# EAGLE schematic Avionics-Test (EAGLE 9.6.2)
DESIGNER: Gabe Adamson; PART_NUMBER: 68-0004; PROJECT: CougSat-1: Avionics; REV: 1.1.5

## Sheet 1 of 14
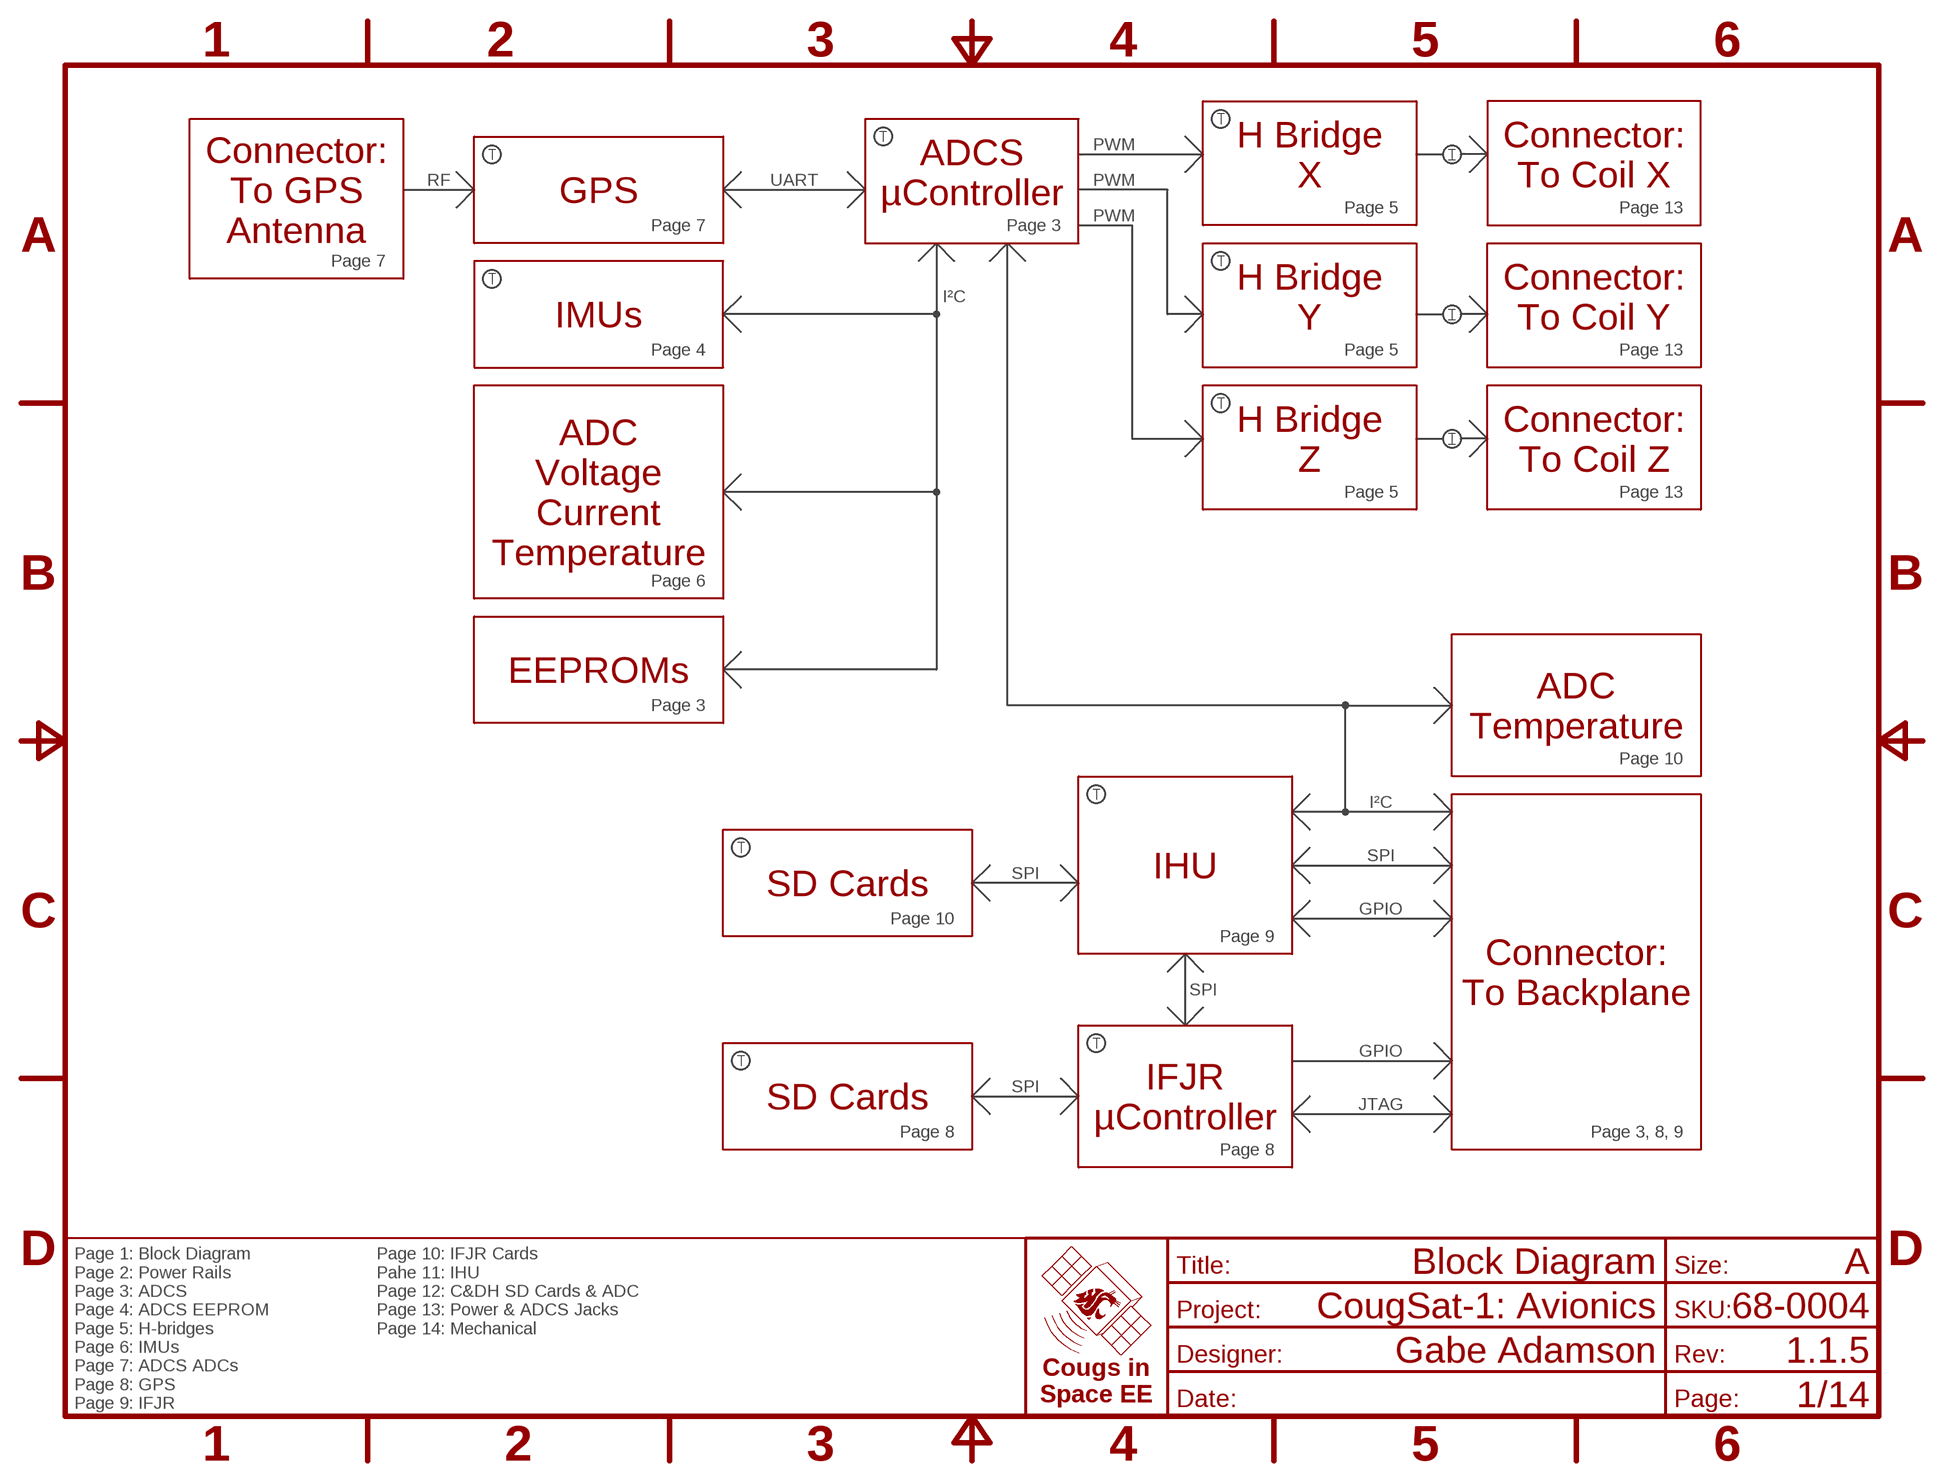
[diagram p0: schematic, sheet 1]
FRAME1 (FRAME-A): TITLE: Block Diagram

### Notes on the sheet
- PWM
- H Bridge
  X
- Connector:
  To Coil X
- ADCS
  µController
- RF | UART | PWM
- Connector:
  To GPS
  Antenna
- GPS
- Page 5 | Page 13
- Page 7 | Page 3 | PWM
- Page 7
- I²C
- H Bridge
  Y
- Connector:
  To Coil Y
- IMUs
- Page 4 | Page 5 | Page 13
- H Bridge
  Z
- Connector:
  To Coil Z
- ADC
  Voltage
  Current
  Temperature
- Page 5 | Page 13
- Page 6
- EEPROMs
- Page 3
- ADC
  Temperature
- Page 10
- I²C
- IHU | SPI
- SD Cards | SPI
- Page 10 | GPIO
- Page 9
- Connector:
  To Backplane
- SPI
- GPIO
- SD Cards | SPI
- IFJR
  µController
- JTAG
- Page 8 | Page 3, 8, 9
- Page 8
- Page 1: Block Diagram
  Page 2: Power Rails
  Page 3: ADCS
  Page 4: ADCS EEPROM
  Page 5: H-bridges
  Page 6: IMUs
  Page 7: ADCS ADCs
  Page 8: GPS
  Page 9: IFJR
- Page 10: IFJR Cards
  Pahe 11: IHU
  Page 12: C&DH SD Cards & ADC
  Page 13: Power & ADCS Jacks
  Page 14: Mechanical

## Sheet 2 of 14
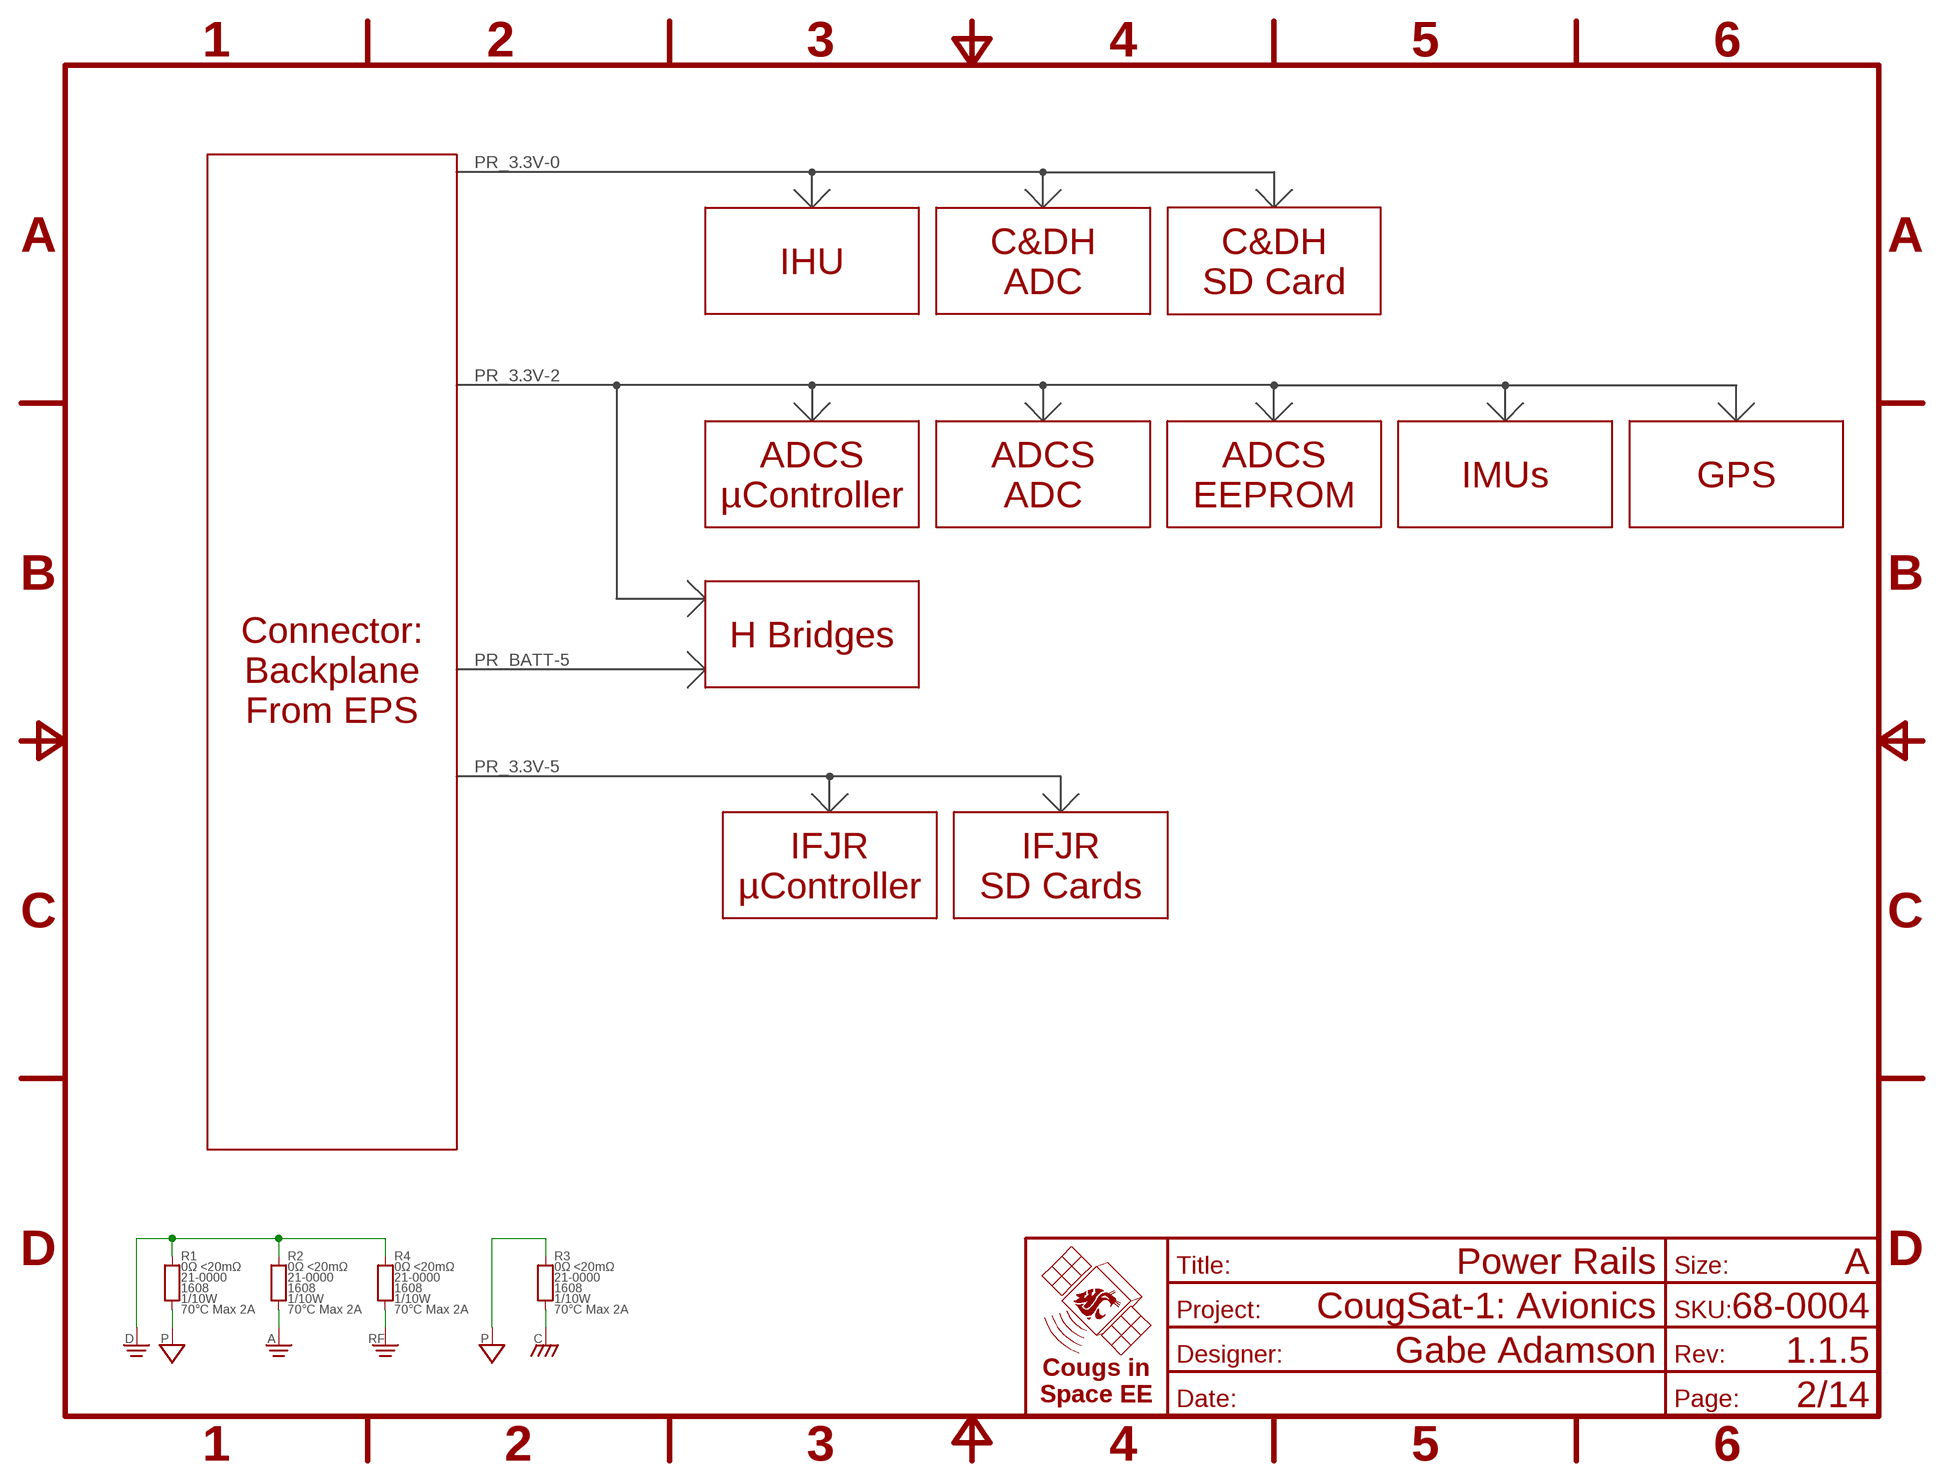
[diagram p1: schematic, sheet 2]
FRAME2 (FRAME-A): TITLE: Power Rails

### Parts
R1  0Ω <20mΩ  RES-V-0-1608  [1608]
R2  0Ω <20mΩ  RES-V-0-1608  [1608]
R3  0Ω <20mΩ  RES-V-0-1608  [1608]
R4  0Ω <20mΩ  RES-V-0-1608  [1608]

### Nets
AGND [Power]: R2.1 ; also sheet 3,5,6,7,8,9,10,11,12
CHASSIS [Power]: R3.1 ; also sheet 13
DGND [Power]: R1.2 R2.2 R4.2 ; also sheet 3,4,6,7,8,9,10,11,12,13
PGND [Power]: R1.1 R3.2 ; also sheet 5,13
RFGND [Power]: R4.1 ; also sheet 8

### Notes on the sheet
- PR_3.3V-0
- IHU
- C&DH
  ADC
- C&DH
  SD Card
- PR_3.3V-2
- ADCS
  µController
- ADCS
  ADC
- ADCS
  EEPROM
- IMUs | GPS
- H Bridges
- PR_BATT-5
- Connector:
  Backplane
  From EPS
- PR_3.3V-5
- IFJR
  µController
- IFJR
  SD Cards

## Sheet 3 of 14
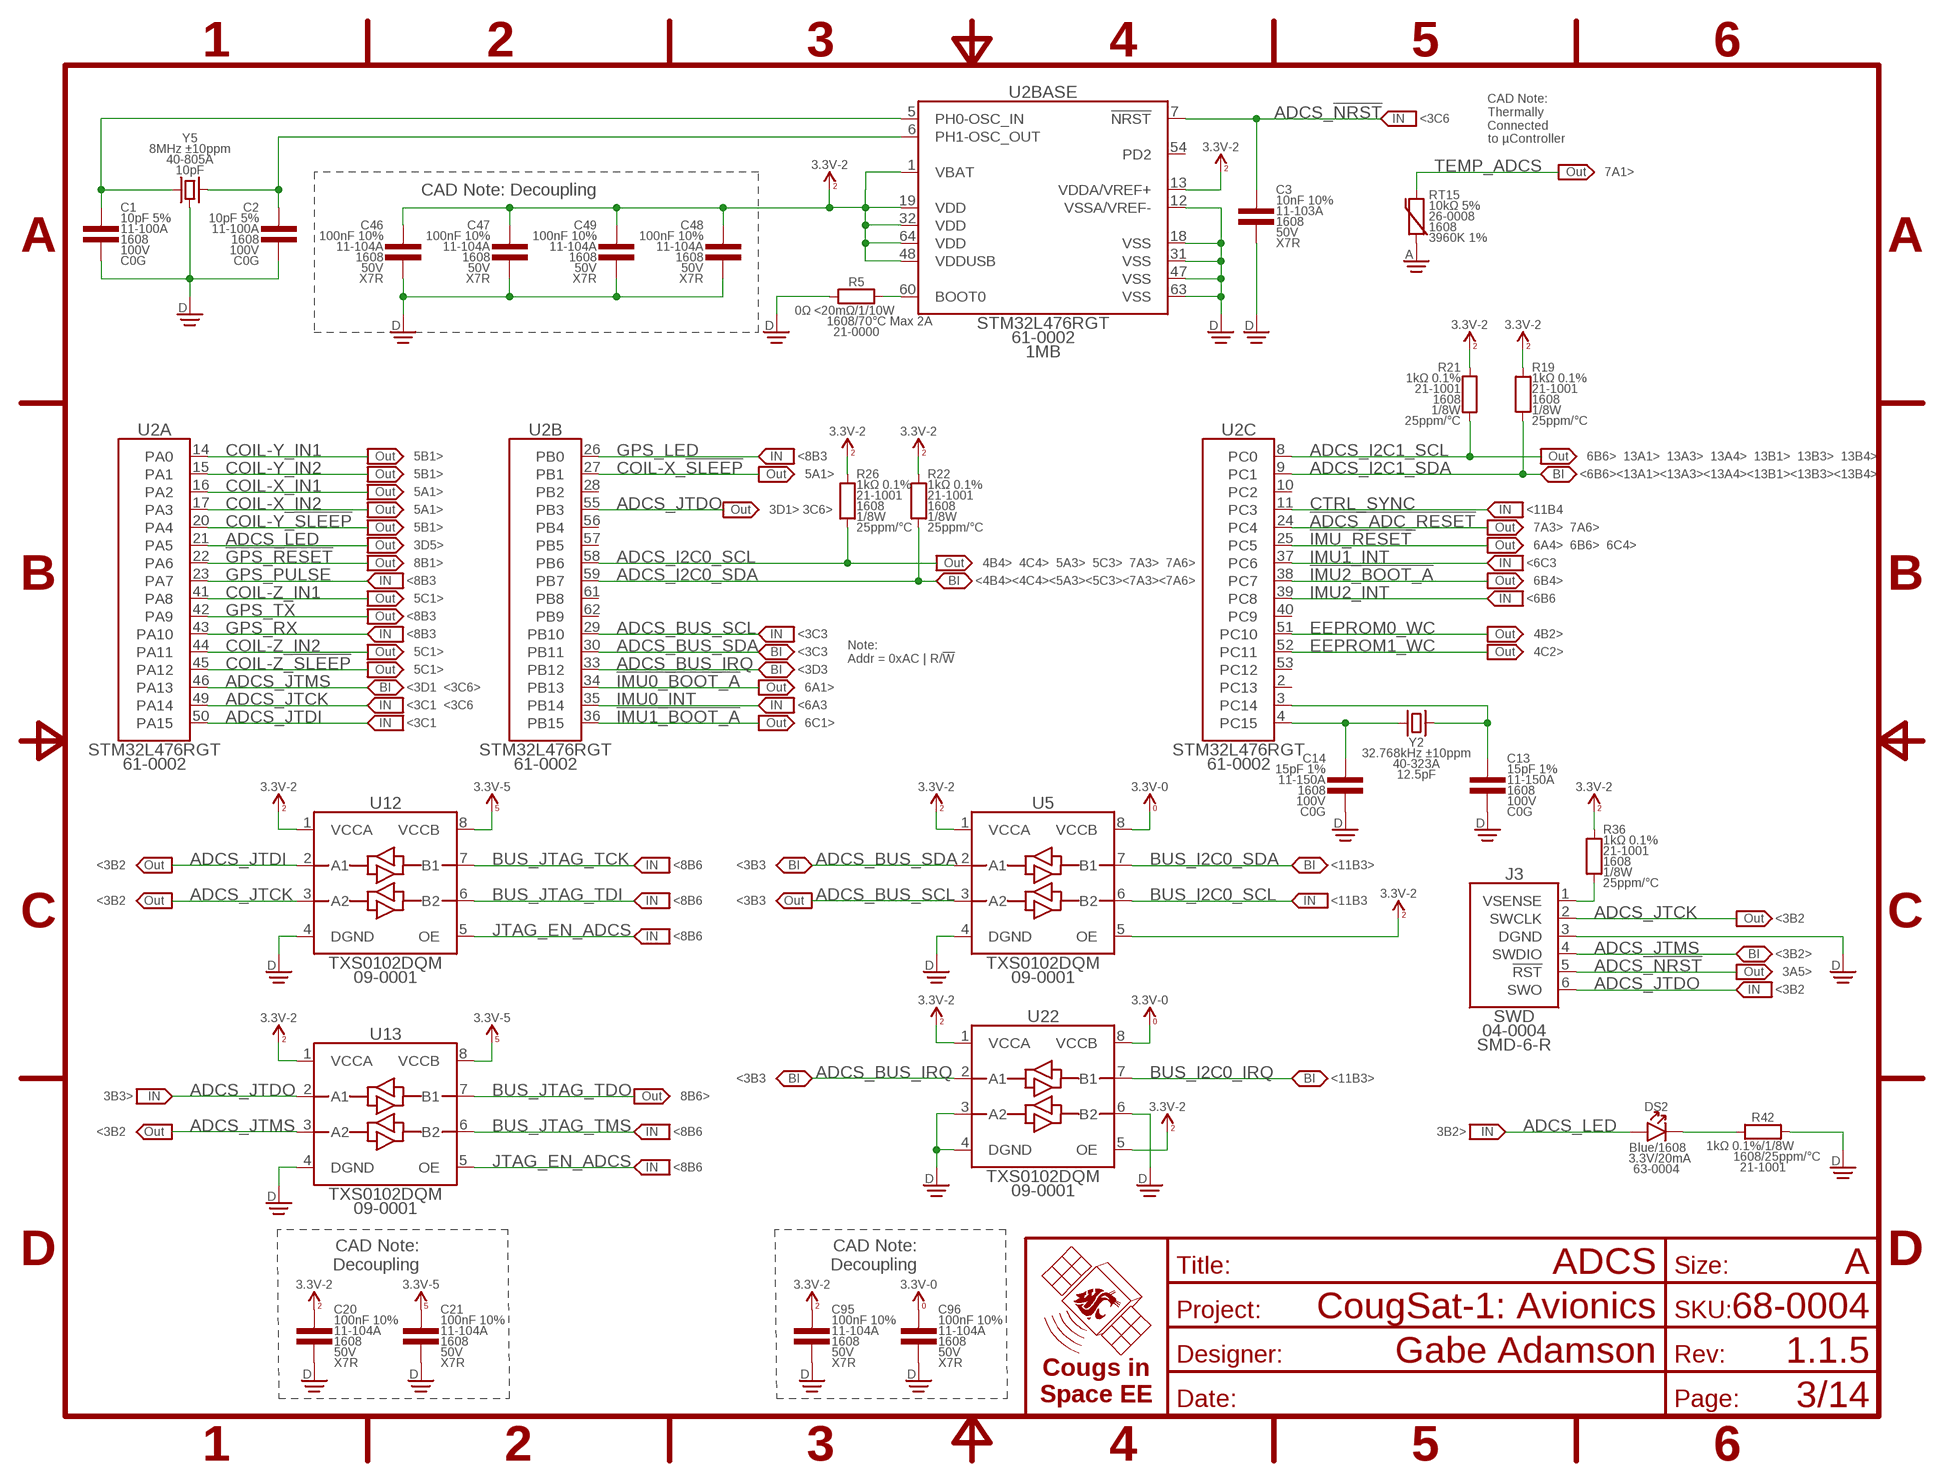
[diagram p2: schematic, sheet 3]
FRAME4 (FRAME-A): TITLE: ADCS

### Parts
C1  10pF 5%  CAP-V-10PF-1608  [1608]
C2  10pF 5%  CAP-V-10PF-1608  [1608]
C3  10nF 10%  CAP-V-10NF-1608  [1608]
C13  15pF 1%  CAP-V-15PF-1608  [1608]
C14  15pF 1%  CAP-V-15PF-1608  [1608]
C20  100nF 10%  CAP-V-100NF-1608  [1608]
C21  100nF 10%  CAP-V-100NF-1608  [1608]
C46  100nF 10%  CAP-V-100NF-1608  [1608]
C47  100nF 10%  CAP-V-100NF-1608  [1608]
C48  100nF 10%  CAP-V-100NF-1608  [1608]
C49  100nF 10%  CAP-V-100NF-1608  [1608]
C95  100nF 10%  CAP-V-100NF-1608  [1608]
C96  100nF 10%  CAP-V-100NF-1608  [1608]
DS2  Blue  LED-H-BLU-1608  [1608-POL]
J3  SWD  SWDSMD-6-R  [SMD2.54-1X06-R]
R5  0Ω <20mΩ  RES-H-0-1608  [1608]
R19  1kΩ 0.1%  RES-V-1K-1608  [1608]
R21  1kΩ 0.1%  RES-V-1K-1608  [1608]
R22  1kΩ 0.1%  RES-V-1K-1608  [1608]
R26  1kΩ 0.1%  RES-V-1K-1608  [1608]
R36  1kΩ 0.1%  RES-V-1K-1608  [1608]
R42  1kΩ 0.1%  RES-H-1K-1608  [1608]
RT15  10kΩ 5%  THERMISTOR-V-10K-1608  [1608]
U2  STM32L476RGT  STM32-64P-L476RGT  [QFP-64-1010]
U5  TXS0102DQM  LEVEL_SHIFTER-2BIT-XSON-8  [X2SON-8]
U12  TXS0102DQM  LEVEL_SHIFTER-2BIT-XSON-8  [X2SON-8]
U13  TXS0102DQM  LEVEL_SHIFTER-2BIT-XSON-8  [X2SON-8]
U22  TXS0102DQM  LEVEL_SHIFTER-2BIT-XSON-8  [X2SON-8]
Y2  32.768kHz ±10ppm  CRYSTAL-32.768K-SMD-3215  [SMD-3215]
Y5  8MHz ±10ppm  CRYSTAL-GROUNDED-8M-SMD-5032  [SMD-5032]

### Nets
3.3V_0 [Power]: C96.1 U5.8(VCCB) U22.8(VCCB) ; supply symbol labelled 3.3V-0 ; also sheet 9,11,12,13
3.3V_2 [Power]: C20.1 C46.1 C47.1 C48.1 C49.1 C95.1 R19.2 R21.2 R22.2 R26.2 R36.2 U2.1(BASE:VBAT) U2.13(BASE:VDDA/VREF+) U2.19(BASE:VDD) U2.32(BASE:VDD) U2.48(BASE:VDDUSB) U2.64(BASE:VDD) U5.1(VCCA) U5.5(OE) U12.1(VCCA) U13.1(VCCA) U22.1(VCCA) U22.5(OE) ; supply symbol labelled 3.3V-2 ; also sheet 4,5,6,7,8,13
3.3V_5 [Power]: C21.1 U12.8(VCCB) U13.8(VCCB) ; supply symbol labelled 3.3V-5 ; also sheet 9,10,11,13
!ADCS_ADC_RESET!: U2.24(C:PC4) ; also sheet 7
!GPS_RESET: U2.22(A:PA6) ; also sheet 8
!IMU0_BOOT_A: U2.34(B:PB13) ; also sheet 6
!IMU1_BOOT_A: U2.36(B:PB15) ; also sheet 6
!IMU2_BOOT_A: U2.38(C:PC7) ; also sheet 6
!IMU_RESET: U2.25(C:PC5) ; also sheet 6
ADCS_!NRST: C3.1 J3.5(!RST) U2.7(BASE:!NRST)
ADCS_BOOT0: R5.2 U2.60(BASE:BOOT0)
ADCS_BUS_IRQ: U2.33(B:PB12) U22.2(A1)
ADCS_BUS_SCL: U2.29(B:PB10) U5.3(A2)
ADCS_BUS_SDA: U2.30(B:PB11) U5.2(A1)
ADCS_I2C0_SCL: R26.1 U2.58(B:PB6) ; also sheet 4,6,7
ADCS_I2C0_SDA: R22.1 U2.59(B:PB7) ; also sheet 4,6,7
ADCS_I2C1_SCL: R21.1 U2.8(C:PC0) ; also sheet 6,13
ADCS_I2C1_SDA: R19.1 U2.9(C:PC1) ; also sheet 6,13
ADCS_JTCK: J3.2(SWCLK) U2.49(A:PA14) U12.3(A2)
ADCS_JTDI: U2.50(A:PA15) U12.2(A1)
ADCS_JTDO: J3.6(SWO) U2.55(B:PB3) U13.2(A1)
ADCS_JTMS: J3.4(SWDIO) U2.46(A:PA13) U13.3(A2)
ADCS_LED: DS2.A U2.21(A:PA5)
ADCS_LED_GND: DS2.C R42.1
ADCS_OSC_32_IN: C14.1 U2.4(C:PC15) Y2.1
ADCS_OSC_32_OUT: C13.1 U2.3(C:PC14) Y2.2
ADCS_OSC_IN [Power]: C1.1 U2.5(BASE:PH0-OSC_IN) Y5.1
ADCS_OSC_OUT: C2.1 U2.6(BASE:PH1-OSC_OUT) Y5.3
ADCS_SWD_VSENCE: J3.1(VSENSE) R36.1
AGND [Power]: RT15.1 ; also sheet 2,5,6,7,8,9,10,11,12
BUS_I2C0_IRQ: U22.7(B1) ; also sheet 11
BUS_I2C0_SCL: U5.6(B2) ; also sheet 11
BUS_I2C0_SDA: U5.7(B1) ; also sheet 11
BUS_JTAG_TCK: U12.7(B1) ; also sheet 9,11
BUS_JTAG_TDI: U12.6(B2) ; also sheet 9,11
BUS_JTAG_TDO: U13.7(B1) ; also sheet 9,11
BUS_JTAG_TMS: U13.6(B2) ; also sheet 9,11
COIL-X_!SLEEP: U2.27(B:PB1) ; also sheet 5
COIL-X_IN1: U2.16(A:PA2) ; also sheet 5
COIL-X_IN2: U2.17(A:PA3) ; also sheet 5
COIL-Y_!SLEEP: U2.20(A:PA4) ; also sheet 5
COIL-Y_IN1: U2.14(A:PA0) ; also sheet 5
COIL-Y_IN2: U2.15(A:PA1) ; also sheet 5
COIL-Z_!SLEEP: U2.45(A:PA12) ; also sheet 5
COIL-Z_IN1: U2.41(A:PA8) ; also sheet 5
COIL-Z_IN2: U2.44(A:PA11) ; also sheet 5
CTRL_SYNC: U2.11(C:PC3) ; also sheet 9,11
DGND [Power]: C1.2 C2.2 C3.2 C13.2 C14.2 C20.2 C21.2 C46.2 C47.2 C48.2 C49.2 C95.2 C96.2 J3.3(DGND) R5.1 R42.2 U2.12(BASE:VSSA/VREF-) U2.18(BASE:VSS) U2.31(BASE:VSS) U2.47(BASE:VSS) U2.63(BASE:VSS) U5.4(DGND) U12.4(DGND) U13.4(DGND) U22.3(A2) U22.4(DGND) U22.6(B2) Y5.2(GND) Y5.4(GND) ; also sheet 2,4,6,7,8,9,10,11,12,13
EEPROM0_WC: U2.51(C:PC10) ; also sheet 4
EEPROM1_WC: U2.52(C:PC11) ; also sheet 4
GPS_LED: U2.26(B:PB0) ; also sheet 8
GPS_PULSE: U2.23(A:PA7) ; also sheet 8
GPS_RX: U2.43(A:PA10) ; also sheet 8
GPS_TX: U2.42(A:PA9) ; also sheet 8
IMU0_INT: U2.35(B:PB14) ; also sheet 6
IMU1_INT: U2.37(C:PC6) ; also sheet 6
IMU2_INT: U2.39(C:PC8) ; also sheet 6
JTAG_EN_ADCS: U12.5(OE) U13.5(OE) ; also sheet 9
TEMP_ADCS: RT15.2 ; also sheet 7
Unconnected: U2.2(C:PC13) U2.10(C:PC2) U2.28(B:PB2) U2.40(C:PC9) U2.53(C:PC12) U2.54(BASE:EXTRA_PIN) U2.56(B:PB4) U2.57(B:PB5) U2.61(B:PB8) U2.62(B:PB9)

### Notes on the sheet
- <3C6
- CAD Note:
  Thermally
  Connected
  to µController
- 7A1>
- CAD Note: Decoupling
- 5B1> | <8B3 | 6B6>  13A1>  13A3>  13A4>  13B1>  13B3>  13B4>
- 5B1> | 5A1> | <6B6><13A1><13A3><13A4><13B1><13B3><13B4>
- 5A1>
- 5A1> | 3D1> 3C6> | <11B4
- 5B1> | 7A3>  7A6>
- 3D5> | 6A4>  6B6>  6C4>
- 8B1> | 4B4>  4C4>  5A3>  5C3>  7A3>  7A6> | <6C3
- <8B3 | <4B4><4C4><5A3><5C3><7A3><7A6> | 6B4>
- 5C1> | <6B6
- <8B3
- <8B3 | <3C3 | 4B2>
- 5C1> | <3C3
- Note:
  Addr = 0xAC | R/!W!
- 4C2>
- 5C1> | <3D3
- <3D1  <3C6> | 6A1>
- <3C1  <3C6 | <6A3
- <3C1 | 6C1>
- <3B2 | <8B6 | <3B3 | <11B3>
- <3B2 | <8B6 | <3B3 | <11B3
- <3B2
- <8B6
- <3B2>
- 3A5>
- <3B2
- <3B3 | <11B3>
- 3B3> | 8B6>
- <3B2 | <8B6 | 3B2>
- <8B6
- CAD Note:
  Decoupling
- CAD Note:
  Decoupling

## Sheet 4 of 14
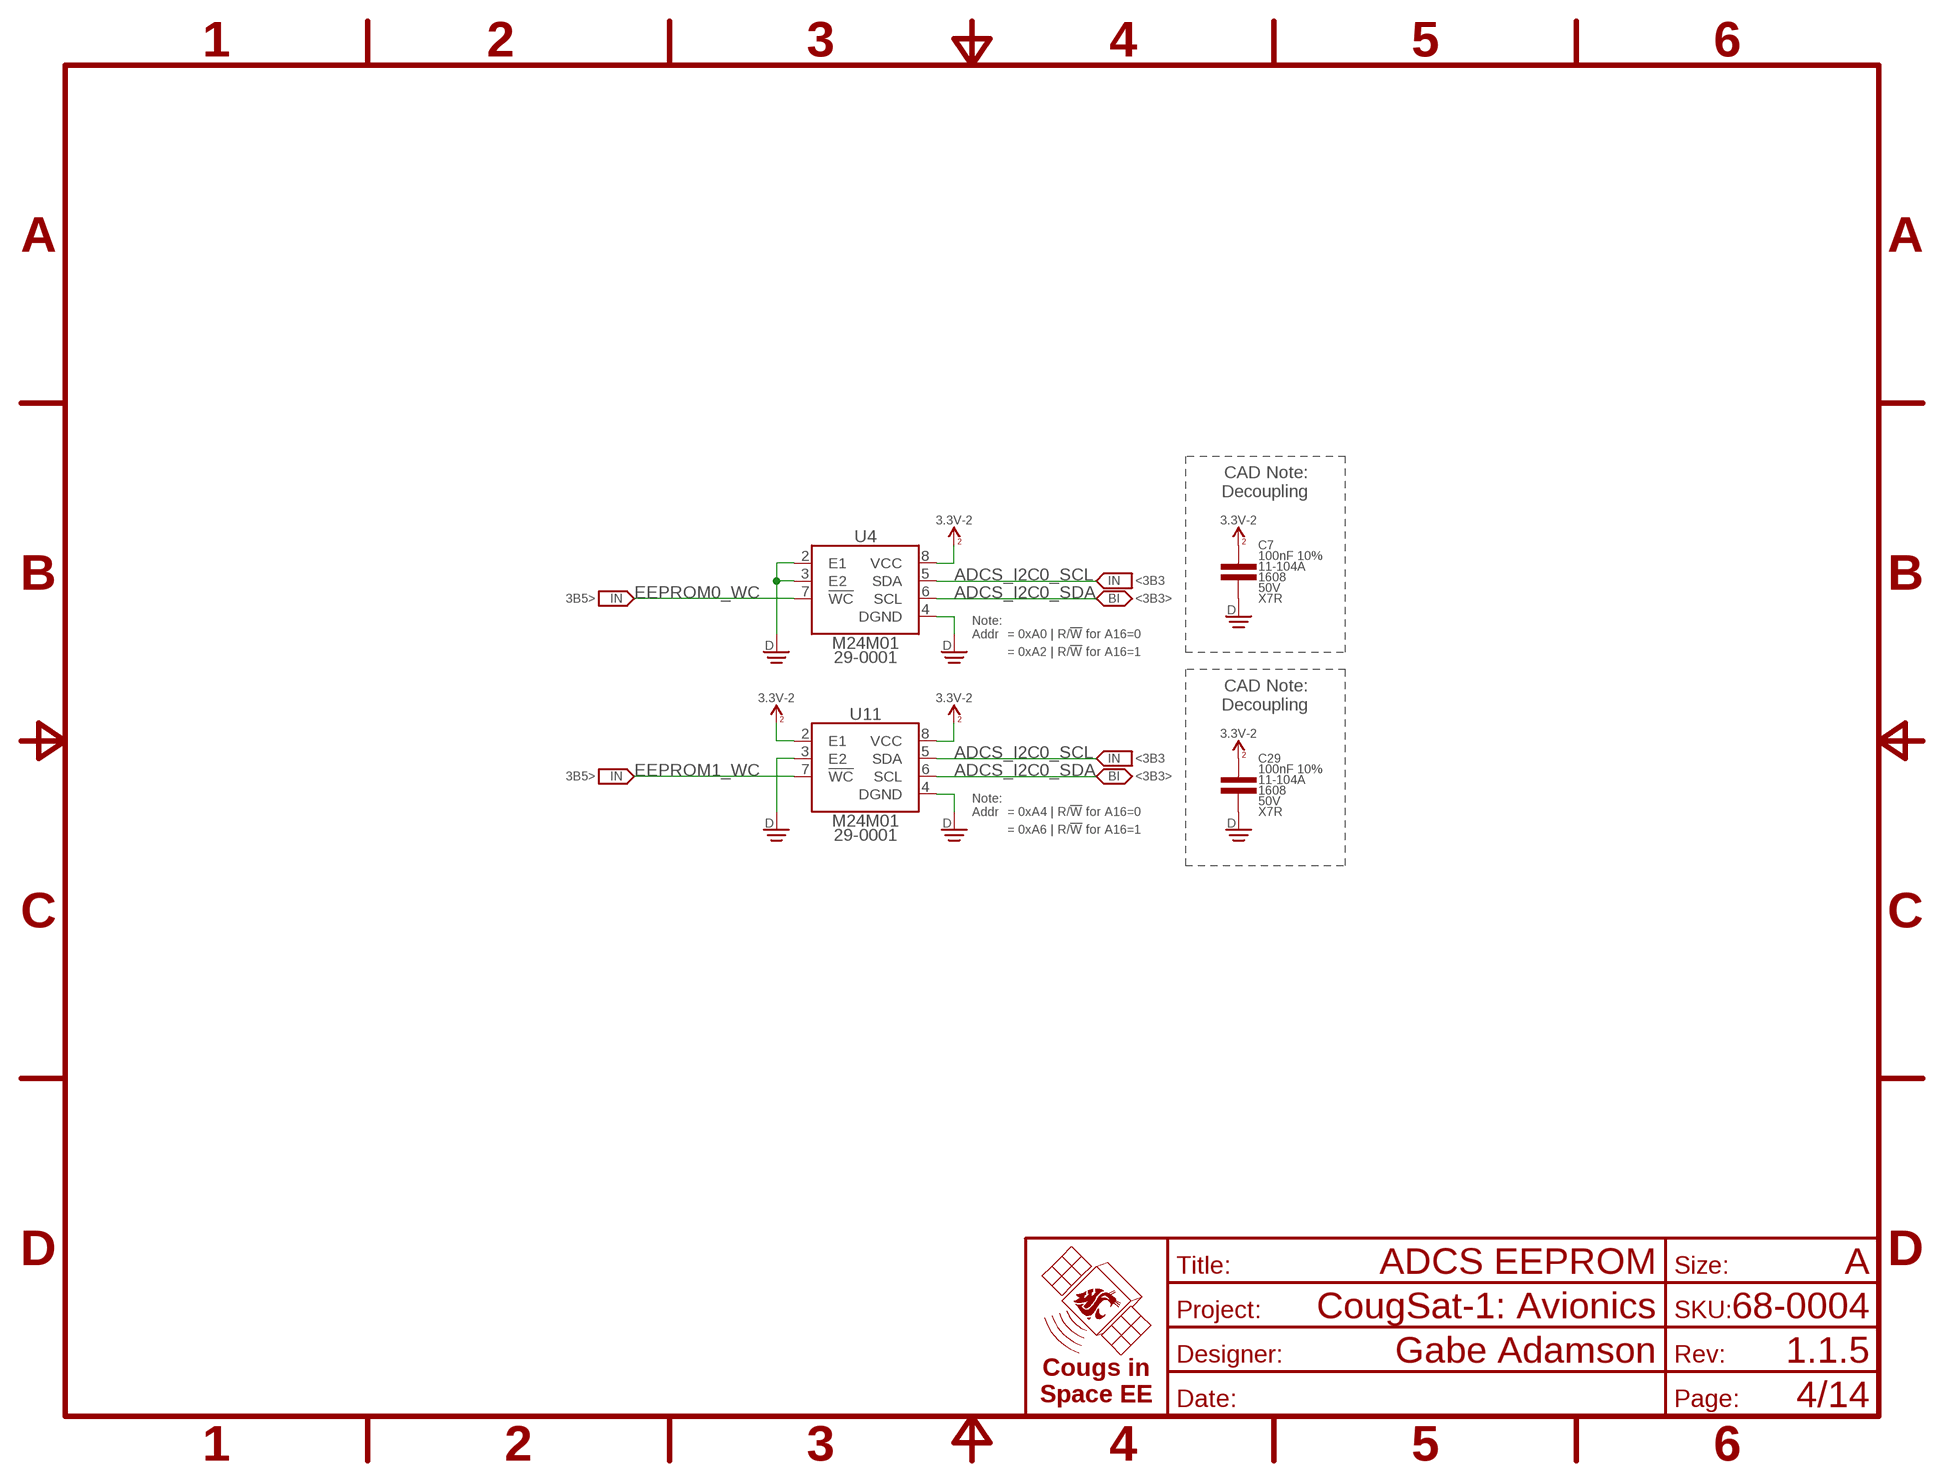
[diagram p3: schematic, sheet 4]
FRAME13 (FRAME-A): TITLE: ADCS EEPROM

### Parts
C7  100nF 10%  CAP-V-100NF-1608  [1608]
C29  100nF 10%  CAP-V-100NF-1608  [1608]
U4  M24M01  EEPROM-I2C-4-128KB-SO8  [SO8]
U11  M24M01  EEPROM-I2C-4-128KB-SO8  [SO8]

### Nets
3.3V_2 [Power]: C7.1 C29.1 U4.8(VCC) U11.2(E1) U11.8(VCC) ; supply symbol labelled 3.3V-2 ; also sheet 3,5,6,7,8,13
ADCS_I2C0_SCL: U4.5(SDA) U11.5(SDA) ; also sheet 3,6,7
ADCS_I2C0_SDA: U4.6(SCL) U11.6(SCL) ; also sheet 3,6,7
DGND [Power]: C7.2 C29.2 U4.2(E1) U4.3(E2) U4.4(DGND) U11.3(E2) U11.4(DGND) ; also sheet 2,3,6,7,8,9,10,11,12,13
EEPROM0_WC: U4.7(!WC) ; also sheet 3
EEPROM1_WC: U11.7(!WC) ; also sheet 3

### Notes on the sheet
- CAD Note:
  Decoupling
- <3B3
- 3B5> | <3B3>
- Note:
  Addr
- = 0xA0 | R/!W! for A16=0
- = 0xA2 | R/!W! for A16=1
- CAD Note:
  Decoupling
- <3B3
- 3B5> | <3B3>
- Note:
  Addr
- = 0xA4 | R/!W! for A16=0
- = 0xA6 | R/!W! for A16=1

## Sheet 5 of 14
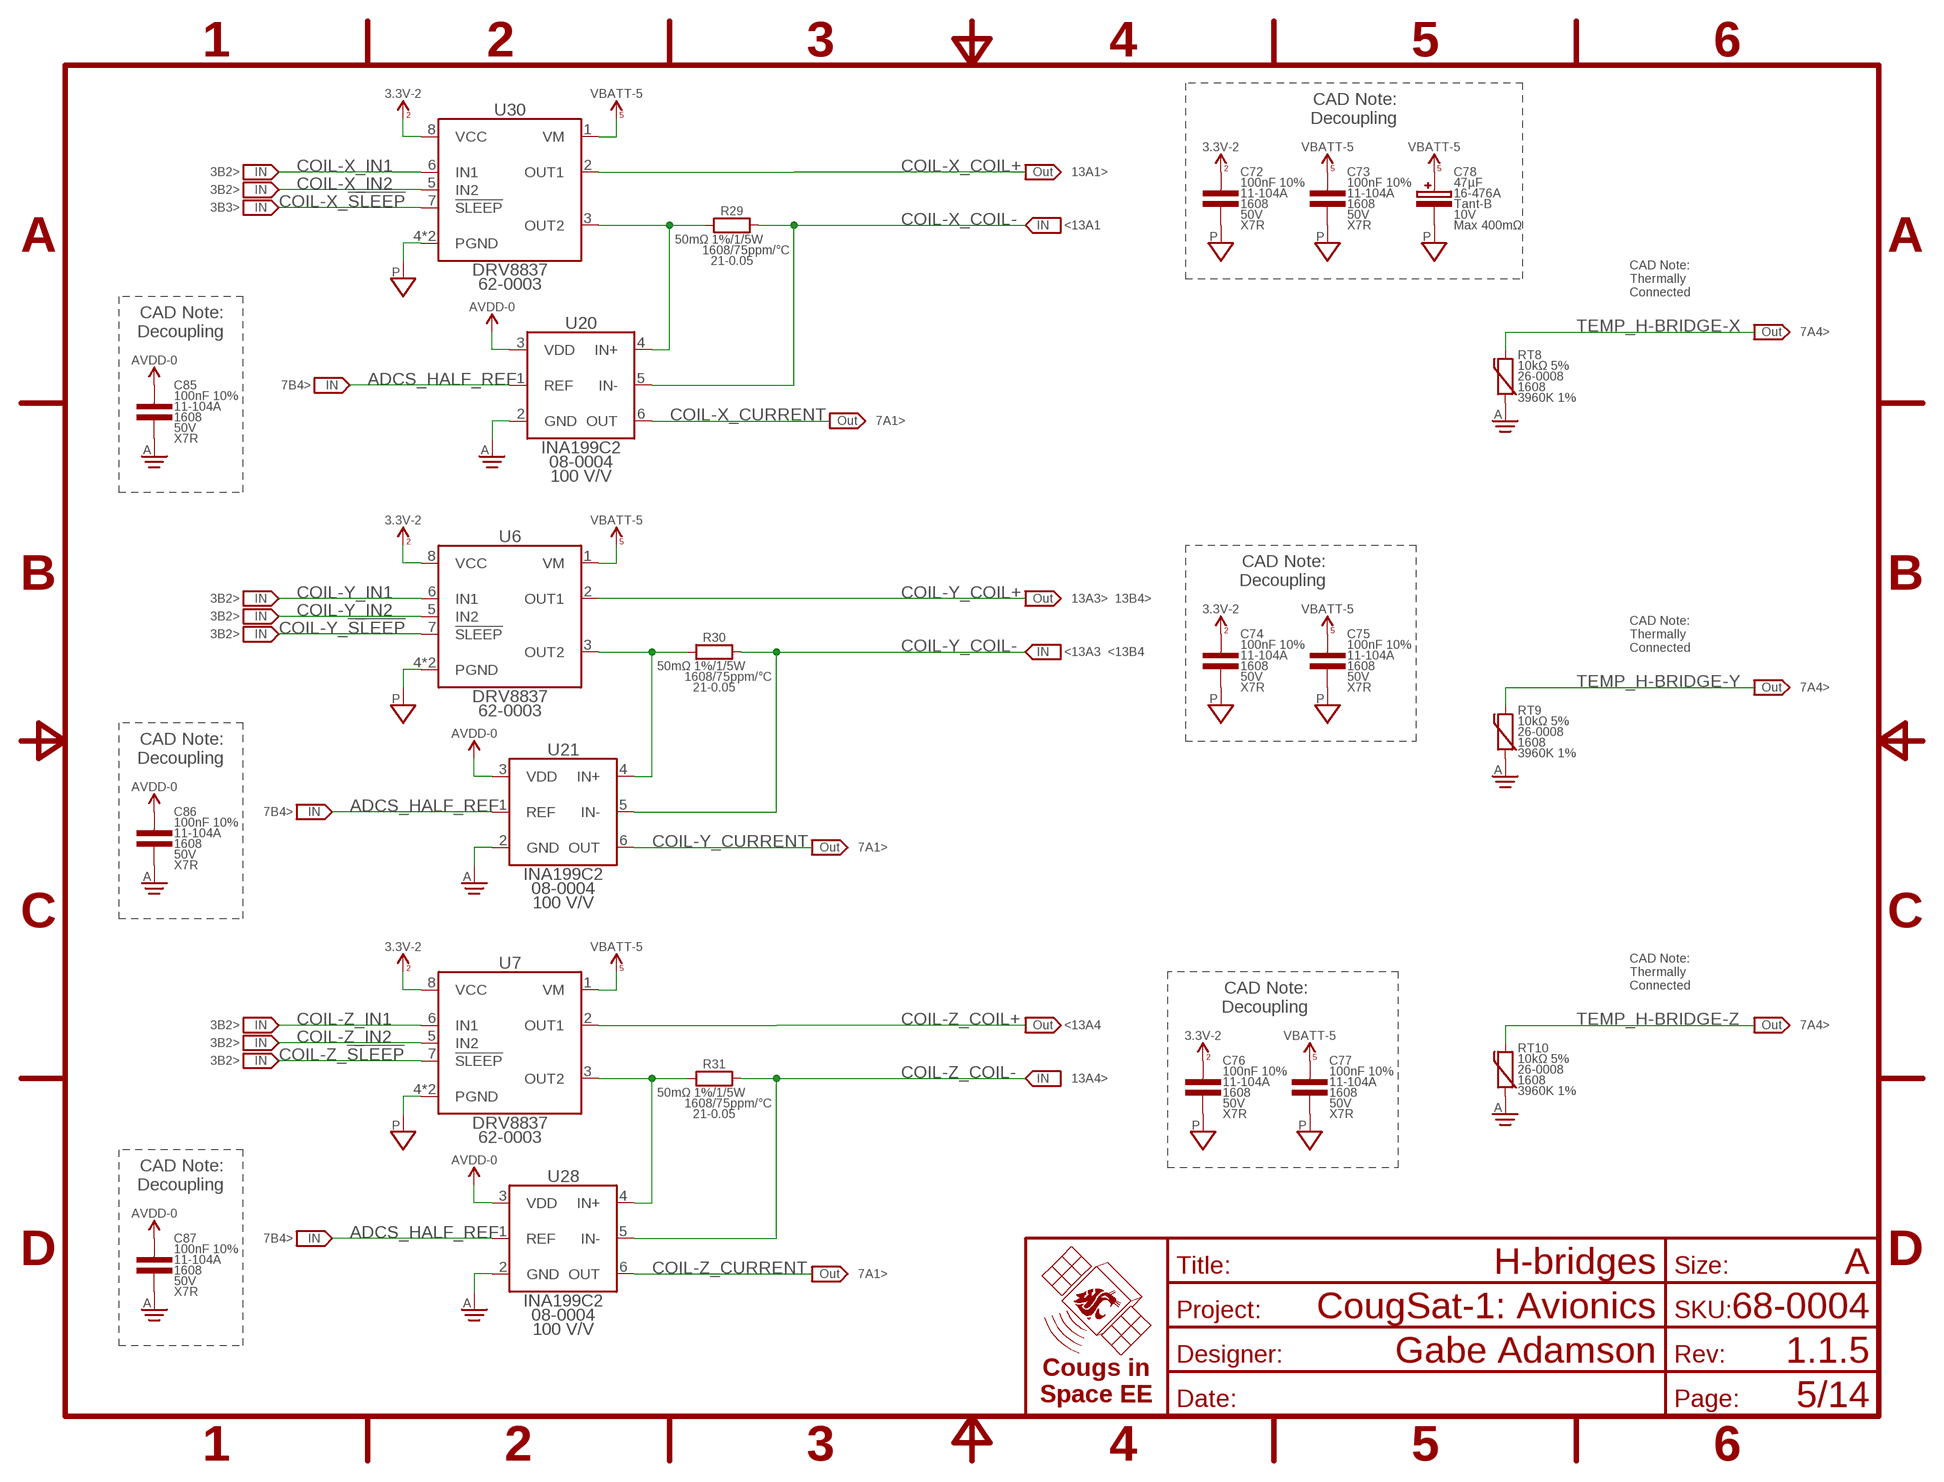
[diagram p4: schematic, sheet 5]
FRAME5 (FRAME-A): TITLE: H-bridges

### Parts
C72  100nF 10%  CAP-V-100NF-1608  [1608]
C73  100nF 10%  CAP-V-100NF-1608  [1608]
C74  100nF 10%  CAP-V-100NF-1608  [1608]
C75  100nF 10%  CAP-V-100NF-1608  [1608]
C76  100nF 10%  CAP-V-100NF-1608  [1608]
C77  100nF 10%  CAP-V-100NF-1608  [1608]
C78  47µF  CAP-POL-V-47UF-4028  [4028-POL]
C85  100nF 10%  CAP-V-100NF-1608  [1608]
C86  100nF 10%  CAP-V-100NF-1608  [1608]
C87  100nF 10%  CAP-V-100NF-1608  [1608]
R29  50mΩ 1%  RES-H-0.05R-1608  [1608]
R30  50mΩ 1%  RES-H-0.05R-1608  [1608]
R31  50mΩ 1%  RES-H-0.05R-1608  [1608]
RT8  10kΩ 5%  THERMISTOR-V-10K-1608  [1608]
RT9  10kΩ 5%  THERMISTOR-V-10K-1608  [1608]
RT10  10kΩ 5%  THERMISTOR-V-10K-1608  [1608]
U6  DRV8837  [WSON-8]
U7  DRV8837  [WSON-8]
U20  INA199C2  [SOT363]
U21  INA199C2  [SOT363]
U28  INA199C2  [SOT363]
U30  DRV8837  [WSON-8]

### Nets
3.3V_2 [Power]: C72.1 C74.1 C76.1 U6.8(VCC) U7.8(VCC) U30.8(VCC) ; supply symbol labelled 3.3V-2 ; also sheet 3,4,6,7,8,13
ADCS_HALF_REF: U20.1(REF) U21.1(REF) U28.1(REF) ; also sheet 7
AGND [Power]: C85.2 C86.2 C87.2 RT8.1 RT9.1 RT10.1 U20.2(GND) U21.2(GND) U28.2(GND) ; also sheet 2,3,6,7,8,9,10,11,12
AVDD-0 [Power]: C85.1 C86.1 C87.1 U20.3(VDD) U21.3(VDD) U28.3(VDD) ; also sheet 7
COIL-X_!SLEEP: U30.7(!SLEEP) ; also sheet 3
COIL-X_COIL+: U30.2(OUT1) ; also sheet 13
COIL-X_COIL-: R29.2 U20.5(IN-) ; also sheet 13
COIL-X_CURRENT: U20.6(OUT) ; also sheet 7
COIL-X_IN1: U30.6(IN1) ; also sheet 3
COIL-X_IN2: U30.5(IN2) ; also sheet 3
COIL-X_OUT2: R29.1 U20.4(IN+) U30.3(OUT2)
COIL-Y_!SLEEP: U6.7(!SLEEP) ; also sheet 3
COIL-Y_COIL+: U6.2(OUT1) ; also sheet 13
COIL-Y_COIL-: R30.2 U21.5(IN-) ; also sheet 13
COIL-Y_CURRENT: U21.6(OUT) ; also sheet 7
COIL-Y_IN1: U6.6(IN1) ; also sheet 3
COIL-Y_IN2: U6.5(IN2) ; also sheet 3
COIL-Y_OUT2: R30.1 U6.3(OUT2) U21.4(IN+)
COIL-Z_!SLEEP: U7.7(!SLEEP) ; also sheet 3
COIL-Z_COIL+: U7.2(OUT1) ; also sheet 13
COIL-Z_COIL-: R31.2 U28.5(IN-) ; also sheet 13
COIL-Z_CURRENT: U28.6(OUT) ; also sheet 7
COIL-Z_IN1: U7.6(IN1) ; also sheet 3
COIL-Z_IN2: U7.5(IN2) ; also sheet 3
COIL-Z_OUT2: R31.1 U7.3(OUT2) U28.4(IN+)
PGND [Power]: C72.2 C73.2 C74.2 C75.2 C76.2 C77.2 C78.C U6.4(PGND) U6.PAD(PGND) U7.4(PGND) U7.PAD(PGND) U30.4(PGND) U30.PAD(PGND) ; also sheet 2,13
TEMP_H-BRIDGE-X: RT8.2 ; also sheet 7
TEMP_H-BRIDGE-Y: RT9.2 ; also sheet 7
TEMP_H-BRIDGE-Z: RT10.2 ; also sheet 7
VBATT_5 [Power]: C73.1 C75.1 C77.1 C78.A U6.1(VM) U7.1(VM) U30.1(VM) ; supply symbol labelled VBATT-5 ; also sheet 13

### Notes on the sheet
- CAD Note:
  Decoupling
- 3B2> | 13A1>
- 3B2>
- 3B3>
- <13A1
- CAD Note:
  Thermally
  Connected
- 7A4>
- CAD Note:
  Decoupling
- 7B4>
- 7A1>
- CAD Note:
  Decoupling
- 3B2> | 13A3>  13B4>
- 3B2>
- 3B2>
- CAD Note:
  Thermally
  Connected
- <13A3  <13B4
- 7A4>
- CAD Note:
  Decoupling
- 7B4>
- 7A1>
- CAD Note:
  Thermally
  Connected
- CAD Note:
  Decoupling
- 3B2> | <13A4 | 7A4>
- 3B2>
- 3B2>
- 13A4>
- CAD Note:
  Decoupling
- 7B4>
- 7A1>

## Sheet 6 of 14
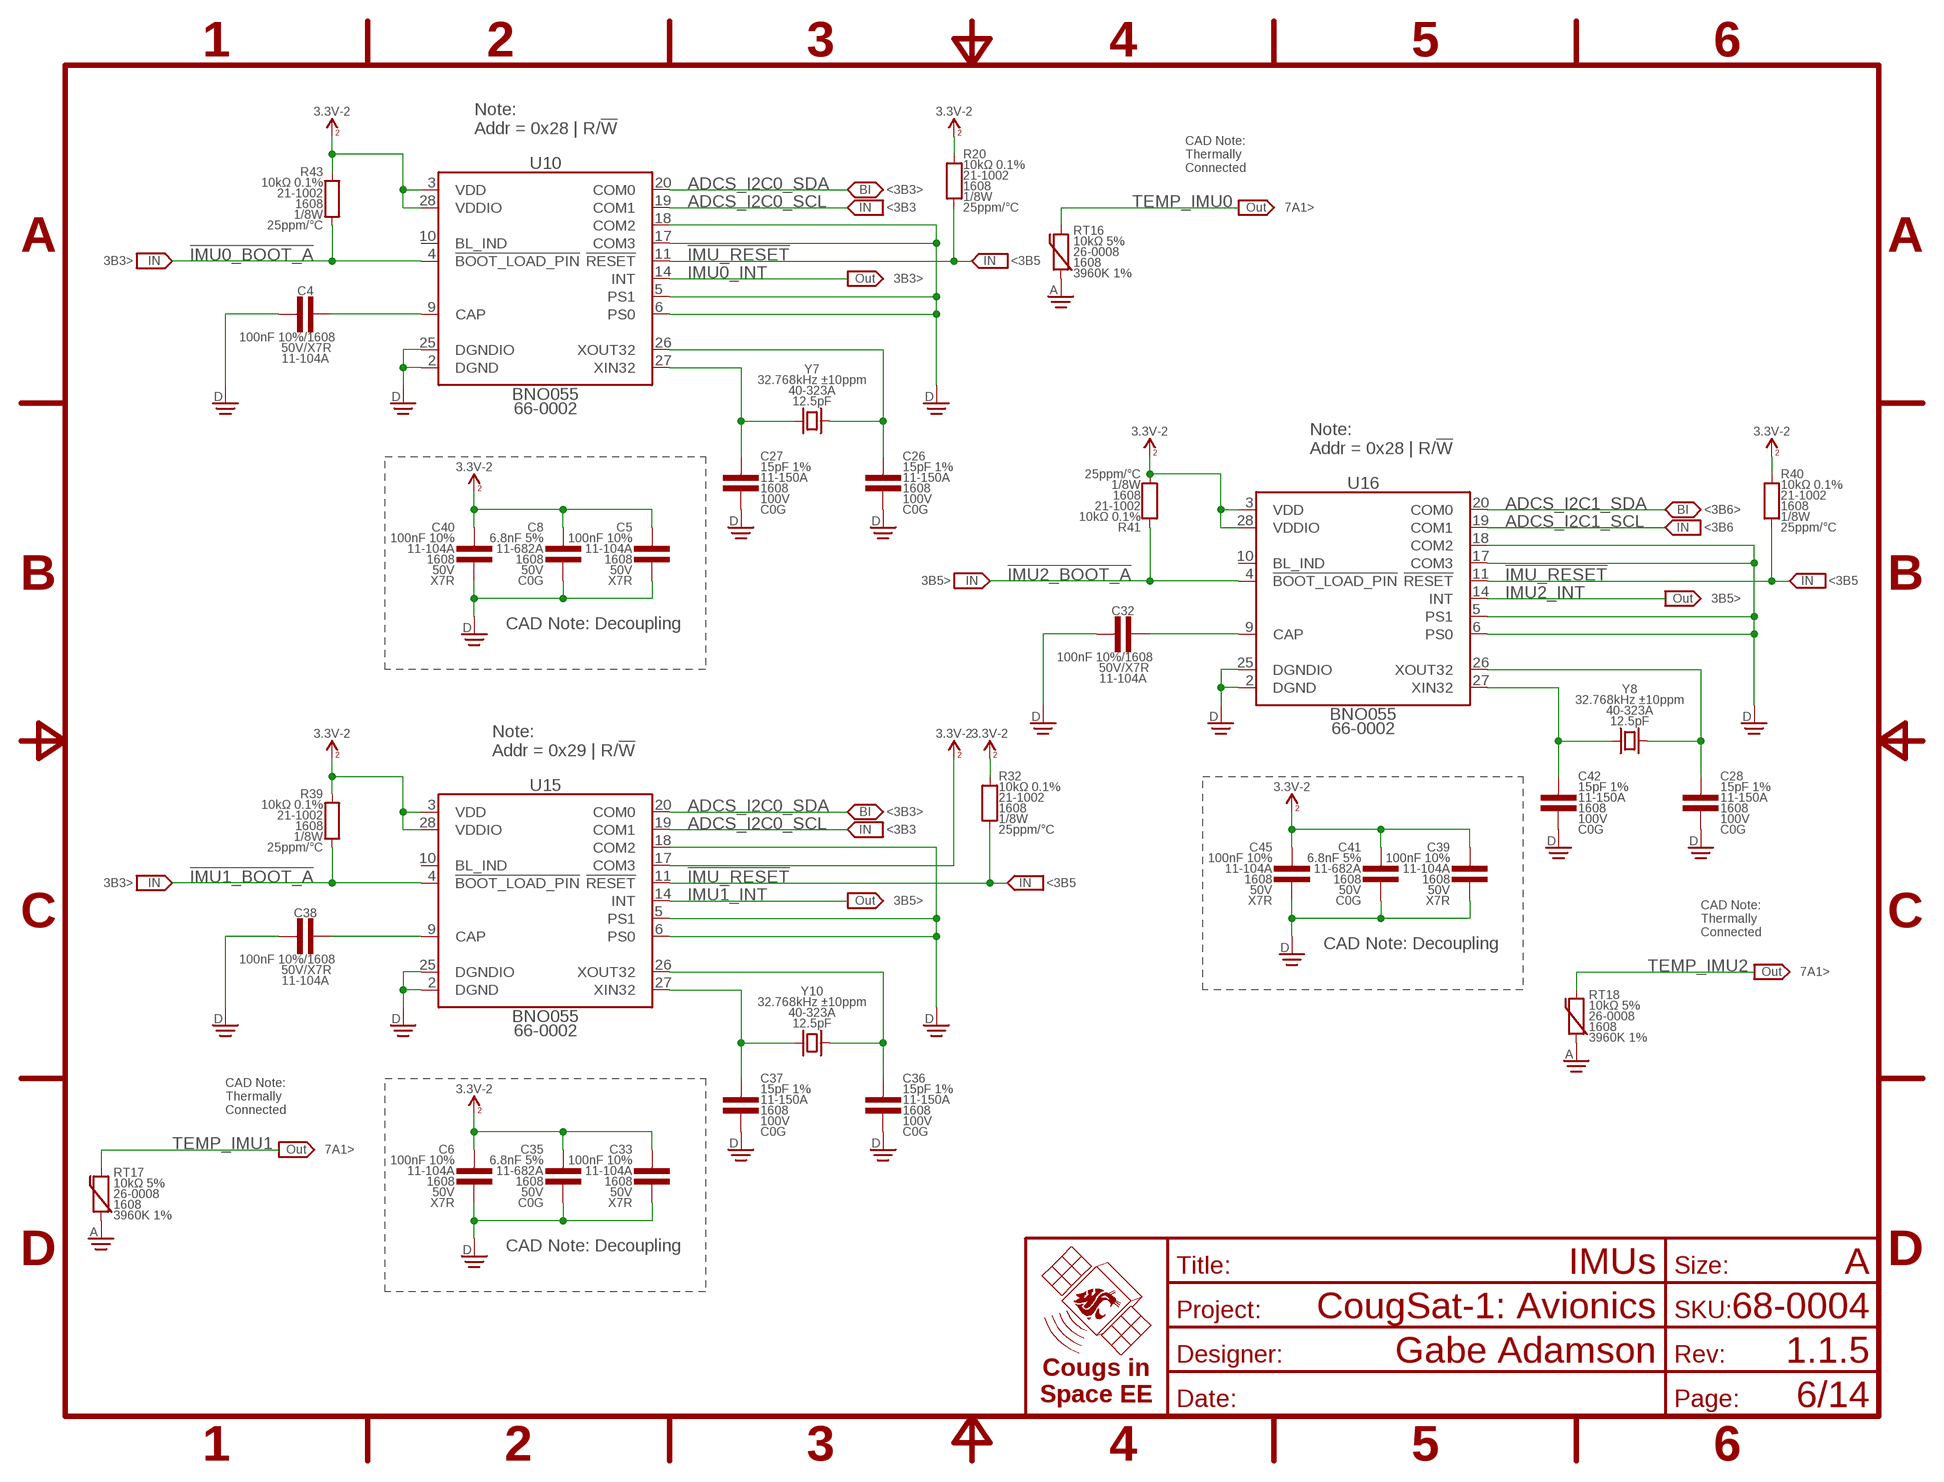
[diagram p5: schematic, sheet 6]
FRAME3 (FRAME-A): TITLE: IMUs

### Parts
C4  100nF 10%  CAP-H-100NF-1608  [1608]
C5  100nF 10%  CAP-V-100NF-1608  [1608]
C6  100nF 10%  CAP-V-100NF-1608  [1608]
C8  6.8nF 5%  CAP-V-6.8NF-1608  [1608]
C26  15pF 1%  CAP-V-15PF-1608  [1608]
C27  15pF 1%  CAP-V-15PF-1608  [1608]
C28  15pF 1%  CAP-V-15PF-1608  [1608]
C32  100nF 10%  CAP-H-100NF-1608  [1608]
C33  100nF 10%  CAP-V-100NF-1608  [1608]
C35  6.8nF 5%  CAP-V-6.8NF-1608  [1608]
C36  15pF 1%  CAP-V-15PF-1608  [1608]
C37  15pF 1%  CAP-V-15PF-1608  [1608]
C38  100nF 10%  CAP-H-100NF-1608  [1608]
C39  100nF 10%  CAP-V-100NF-1608  [1608]
C40  100nF 10%  CAP-V-100NF-1608  [1608]
C41  6.8nF 5%  CAP-V-6.8NF-1608  [1608]
C42  15pF 1%  CAP-V-15PF-1608  [1608]
C45  100nF 10%  CAP-V-100NF-1608  [1608]
R20  10kΩ 0.1%  RES-V-10K-1608  [1608]
R32  10kΩ 0.1%  RES-V-10K-1608  [1608]
R39  10kΩ 0.1%  RES-V-10K-1608  [1608]
R40  10kΩ 0.1%  RES-V-10K-1608  [1608]
R41  10kΩ 0.1%  RES-V-10K-1608  [1608]
R43  10kΩ 0.1%  RES-V-10K-1608  [1608]
RT16  10kΩ 5%  THERMISTOR-V-10K-1608  [1608]
RT17  10kΩ 5%  THERMISTOR-V-10K-1608  [1608]
RT18  10kΩ 5%  THERMISTOR-V-10K-1608  [1608]
U10  BNO055  [LGA-28-4050]
U15  BNO055  [LGA-28-4050]
U16  BNO055  [LGA-28-4050]
Y7  32.768kHz ±10ppm  CRYSTAL-32.768K-SMD-3215  [SMD-3215]
Y8  32.768kHz ±10ppm  CRYSTAL-32.768K-SMD-3215  [SMD-3215]
Y10  32.768kHz ±10ppm  CRYSTAL-32.768K-SMD-3215  [SMD-3215]

### Nets
3.3V_2 [Power]: C5.1 C6.1 C8.1 C33.1 C35.1 C39.1 C40.1 C41.1 C45.1 R20.2 R32.2 R39.2 R40.2 R41.1 R43.2 U10.3(VDD) U10.28(VDDIO) U15.3(VDD) U15.17(COM3) U15.28(VDDIO) U16.3(VDD) U16.28(VDDIO) ; supply symbol labelled 3.3V-2 ; also sheet 3,4,5,7,8,13
!IMU0_BOOT_A: R43.1 U10.4(!BOOT_LOAD_PIN) ; also sheet 3
!IMU1_BOOT_A: R39.1 U15.4(!BOOT_LOAD_PIN) ; also sheet 3
!IMU2_BOOT_A: R41.2 U16.4(!BOOT_LOAD_PIN) ; also sheet 3
!IMU_RESET: R20.1 R32.1 R40.1 U10.11(!RESET) U15.11(!RESET) U16.11(!RESET) ; also sheet 3
ADCS_I2C0_SCL: U10.19(COM1) U15.19(COM1) ; also sheet 3,4,7
ADCS_I2C0_SDA: U10.20(COM0) U15.20(COM0) ; also sheet 3,4,7
ADCS_I2C1_SCL: U16.19(COM1) ; also sheet 3,13
ADCS_I2C1_SDA: U16.20(COM0) ; also sheet 3,13
ADCS_IMU1_OSC_32_IN: C37.1 U15.27(XIN32) Y10.2
ADCS_IMU1_OSC_32_IN1: C27.1 U10.27(XIN32) Y7.2
ADCS_IMU1_OSC_32_IN2: C42.1 U16.27(XIN32) Y8.2
ADCS_IMU1_OSC_32_OUT: C36.1 U15.26(XOUT32) Y10.1
ADCS_IMU1_OSC_32_OUT1: C26.1 U10.26(XOUT32) Y7.1
ADCS_IMU1_OSC_32_OUT2: C28.1 U16.26(XOUT32) Y8.1
AGND [Power]: RT16.1 RT17.1 RT18.1 ; also sheet 2,3,5,7,8,9,10,11,12
DGND [Power]: C4.1 C5.2 C6.2 C8.2 C26.2 C27.2 C28.2 C32.1 C33.2 C35.2 C36.2 C37.2 C38.1 C39.2 C40.2 C41.2 C42.2 C45.2 U10.2(DGND) U10.5(PS1) U10.6(PS0) U10.17(COM3) U10.18(COM2) U10.25(DGNDIO) U15.2(DGND) U15.5(PS1) U15.6(PS0) U15.18(COM2) U15.25(DGNDIO) U16.2(DGND) U16.5(PS1) U16.6(PS0) U16.17(COM3) U16.18(COM2) U16.25(DGNDIO) ; also sheet 2,3,4,7,8,9,10,11,12,13
IMU0_CAP: C4.2 U10.9(CAP)
IMU0_INT: U10.14(INT) ; also sheet 3
IMU1_CAP: C38.2 U15.9(CAP)
IMU1_INT: U15.14(INT) ; also sheet 3
IMU2_CAP: C32.2 U16.9(CAP)
IMU2_INT: U16.14(INT) ; also sheet 3
TEMP_IMU0: RT16.2 ; also sheet 7
TEMP_IMU1: RT17.2 ; also sheet 7
TEMP_IMU2: RT18.2 ; also sheet 7
Unconnected: U10.10(BL_IND) U15.10(BL_IND) U16.10(BL_IND)

### Notes on the sheet
- Note:
  Addr = 0x28 | R/!W
- CAD Note:
  Thermally
  Connected
- <3B3>
- <3B3 | 7A1>
- 3B3> | <3B5
- 3B3>
- Note:
  Addr = 0x28 | R/!W
- <3B6>
- <3B6
- 3B5> | <3B5
- 3B5>
- CAD Note: Decoupling
- Note:
  Addr = 0x29 | R/!W
- <3B3>
- <3B3
- 3B3> | <3B5
- 3B5>
- CAD Note:
  Thermally
  Connected
- CAD Note: Decoupling
- 7A1>
- CAD Note:
  Thermally
  Connected
- 7A1>
- CAD Note: Decoupling

## Sheet 7 of 14
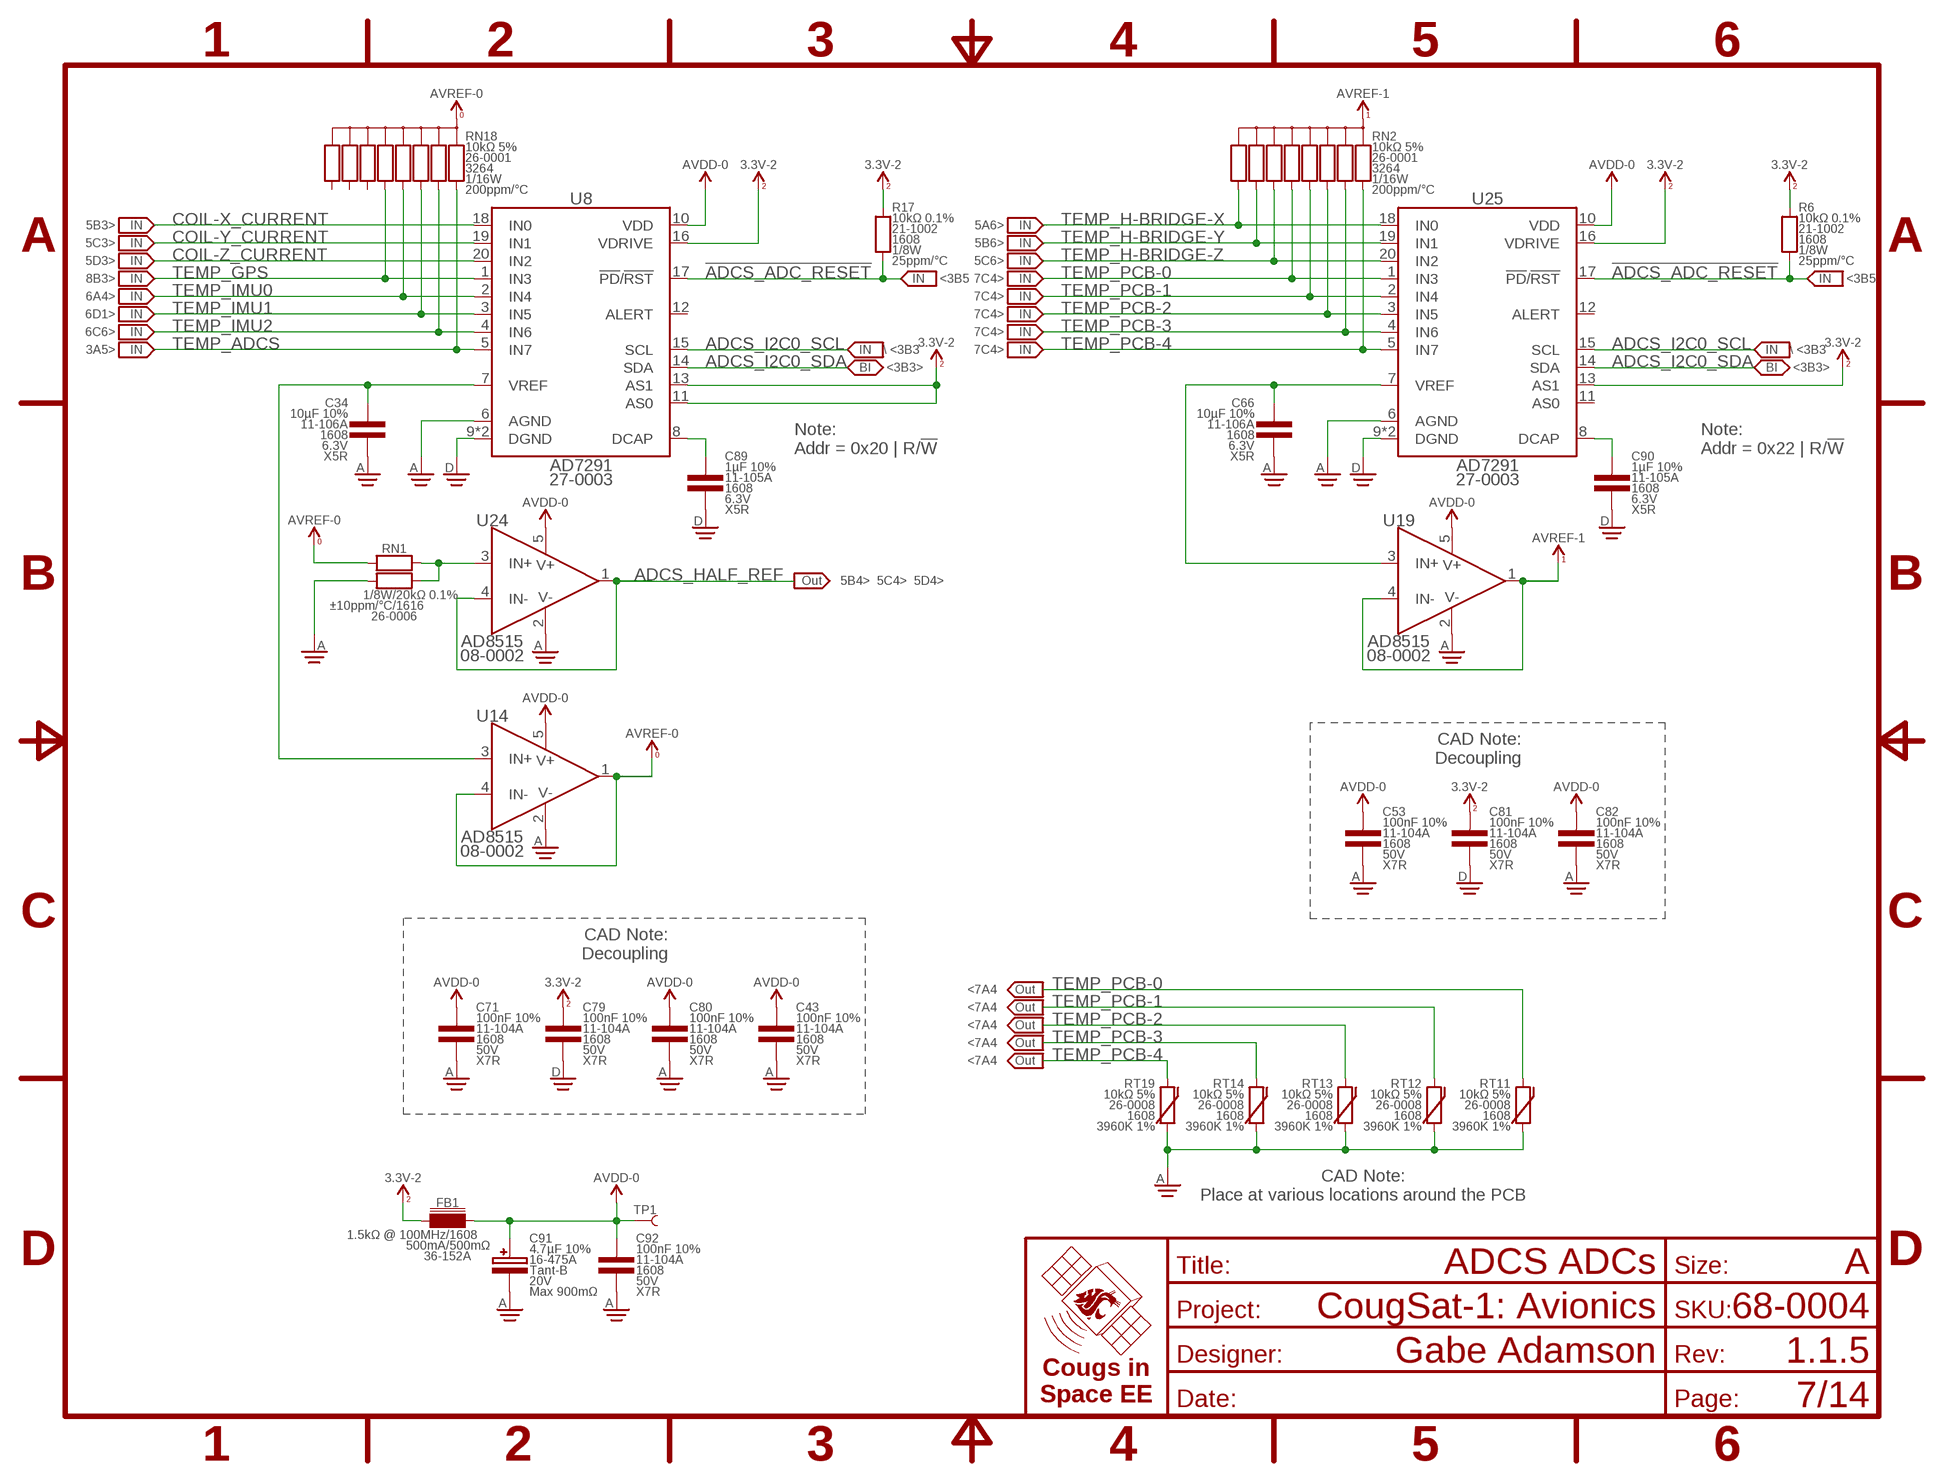
[diagram p6: schematic, sheet 7]
FRAME6 (FRAME-A): TITLE: ADCS ADCs

### Parts
C34  10µF 10%  CAP-V-10UF-1608  [1608]
C43  100nF 10%  CAP-V-100NF-1608  [1608]
C53  100nF 10%  CAP-V-100NF-1608  [1608]
C66  10µF 10%  CAP-V-10UF-1608  [1608]
C71  100nF 10%  CAP-V-100NF-1608  [1608]
C79  100nF 10%  CAP-V-100NF-1608  [1608]
C80  100nF 10%  CAP-V-100NF-1608  [1608]
C81  100nF 10%  CAP-V-100NF-1608  [1608]
C82  100nF 10%  CAP-V-100NF-1608  [1608]
C89  1µF 10%  CAP-V-1UF-1608  [1608]
C90  1µF 10%  CAP-V-1UF-1608  [1608]
C91  4.7µF 10%  CAP-POL-V-4.7UF-4028  [4028-POL]
C92  100nF 10%  CAP-V-100NF-1608  [1608]
FB1  1.5kΩ @ 100MHz  CHOKE-H-1.5K-1608  [1608]
R6  10kΩ 0.1%  RES-V-10K-1608  [1608]
R17  10kΩ 0.1%  RES-V-10K-1608  [1608]
RN1  20kΩ 0.1%  RES-H-PAIRED-20K-1616  [1616]
RN2  10kΩ 5%  RES_BUS-10-10K-3264  [3264]
RN18  10kΩ 5%  RES_BUS-10-10K-3264  [3264]
RT11  10kΩ 5%  THERMISTOR-V-10K-1608  [1608]
RT12  10kΩ 5%  THERMISTOR-V-10K-1608  [1608]
RT13  10kΩ 5%  THERMISTOR-V-10K-1608  [1608]
RT14  10kΩ 5%  THERMISTOR-V-10K-1608  [1608]
RT19  10kΩ 5%  THERMISTOR-V-10K-1608  [1608]
TP1  TEST_POINT-SMD-C-1.25  [SMD-C-1.25]
U8  AD7291  [QFN-20-4040]
U14  AD8515  OPAMP-1-AD8515  [SOT23-5]
U19  AD8515  OPAMP-1-AD8515  [SOT23-5]
U24  AD8515  OPAMP-1-AD8515  [SOT23-5]
U25  AD7291  [QFN-20-4040]

### Nets
3.3V_2 [Power]: C79.1 C81.1 FB1.1 R6.2 R17.2 U8.11(AS0) U8.13(AS1) U8.16(VDRIVE) U25.13(AS1) U25.16(VDRIVE) ; supply symbol labelled 3.3V-2 ; also sheet 3,4,5,6,8,13
!ADCS_ADC_RESET!: R6.1 R17.1 U8.17(!PD!/!RST) U25.17(!PD!/!RST) ; also sheet 3
ADCS_ADC0_DCAP: C89.1 U8.8(DCAP)
ADCS_ADC0_VREF: C34.1 U8.7(VREF) U14.3(IN+)
ADCS_ADC1_DCAP: C90.1 U25.8(DCAP)
ADCS_ADC1_VREF: C66.1 U19.3(IN+) U25.7(VREF)
ADCS_HALF_REF: U24.1(OUT) U24.4(IN-) ; also sheet 5
ADCS_HALF_REF_UNBUFF: RN1.1(A1) RN1.2(B1) U24.3(IN+)
ADCS_I2C0_SCL: U8.15(SCL) U25.15(SCL) ; also sheet 3,4,6
ADCS_I2C0_SDA: U8.14(SDA) U25.14(SDA) ; also sheet 3,4,6
AGND [Power]: C34.2 C43.2 C53.2 C66.2 C71.2 C80.2 C82.2 C91.C C92.2 RN1.4(A2) RT11.1 RT12.1 RT13.1 RT14.1 RT19.1 U8.6(AGND) U14.2(V-) U19.2(V-) U24.2(V-) U25.6(AGND) ; also sheet 2,3,5,6,8,9,10,11,12
AVDD-0 [Power]: C43.1 C53.1 C71.1 C80.1 C82.1 C91.A C92.1 FB1.2 TP1.1 U8.10(VDD) U14.5(V+) U19.5(V+) U24.5(V+) U25.10(VDD) ; also sheet 5
AVREF-0: RN1.3(B2) RN18.5(C) RN18.10(C) U14.1(OUT) U14.4(IN-)
AVREF-1: RN2.5(C) RN2.10(C) U19.1(OUT) U19.4(IN-)
COIL-X_CURRENT: U8.18(IN0) ; also sheet 5
COIL-Y_CURRENT: U8.19(IN1) ; also sheet 5
COIL-Z_CURRENT: U8.20(IN2) ; also sheet 5
DGND [Power]: C79.2 C81.2 C89.2 C90.2 U8.9(DGND) U8.PAD(DGND) U25.9(DGND) U25.PAD(DGND) ; also sheet 2,3,4,6,8,9,10,11,12,13
TEMP_ADCS: RN18.1 U8.5(IN7) ; also sheet 3
TEMP_GPS: RN18.6 U8.1(IN3) ; also sheet 8
TEMP_H-BRIDGE-X: RN2.9 U25.18(IN0) ; also sheet 5
TEMP_H-BRIDGE-Y: RN2.8 U25.19(IN1) ; also sheet 5
TEMP_H-BRIDGE-Z: RN2.7 U25.20(IN2) ; also sheet 5
TEMP_IMU0: RN18.4 U8.2(IN4) ; also sheet 6
TEMP_IMU1: RN18.3 U8.3(IN5) ; also sheet 6
TEMP_IMU2: RN18.2 U8.4(IN6) ; also sheet 6
TEMP_PCB-0: RN2.6 RT11.2 U25.1(IN3)
TEMP_PCB-1: RN2.4 RT12.2 U25.2(IN4)
TEMP_PCB-2: RN2.3 RT13.2 U25.3(IN5)
TEMP_PCB-3: RN2.2 RT14.2 U25.4(IN6)
TEMP_PCB-4: RN2.1 RT19.2 U25.5(IN7)
Unconnected: RN18.7 RN18.8 RN18.9 U8.12(ALERT) U25.11(AS0) U25.12(ALERT)

### Notes on the sheet
- 5B3> | 5A6>
- 5C3> | 5B6>
- 5D3> | 5C6>
- 8B3> | <3B5 | 7C4> | <3B5
- 6A4> | 7C4>
- 6D1> | 7C4>
- 6C6> | 7C4>
- 3A5> | \ <3B3 | 7C4> | \ <3B3
- <3B3> | <3B3>
- Note:
  Addr = 0x20 | R/!W
- Note:
  Addr = 0x22 | R/!W
- 5B4>  5C4>  5D4>
- CAD Note:
  Decoupling
- CAD Note:
  Decoupling
- <7A4
- <7A4
- <7A4
- <7A4
- <7A4
- CAD Note:
  Place at various locations around the PCB

## Sheet 8 of 14
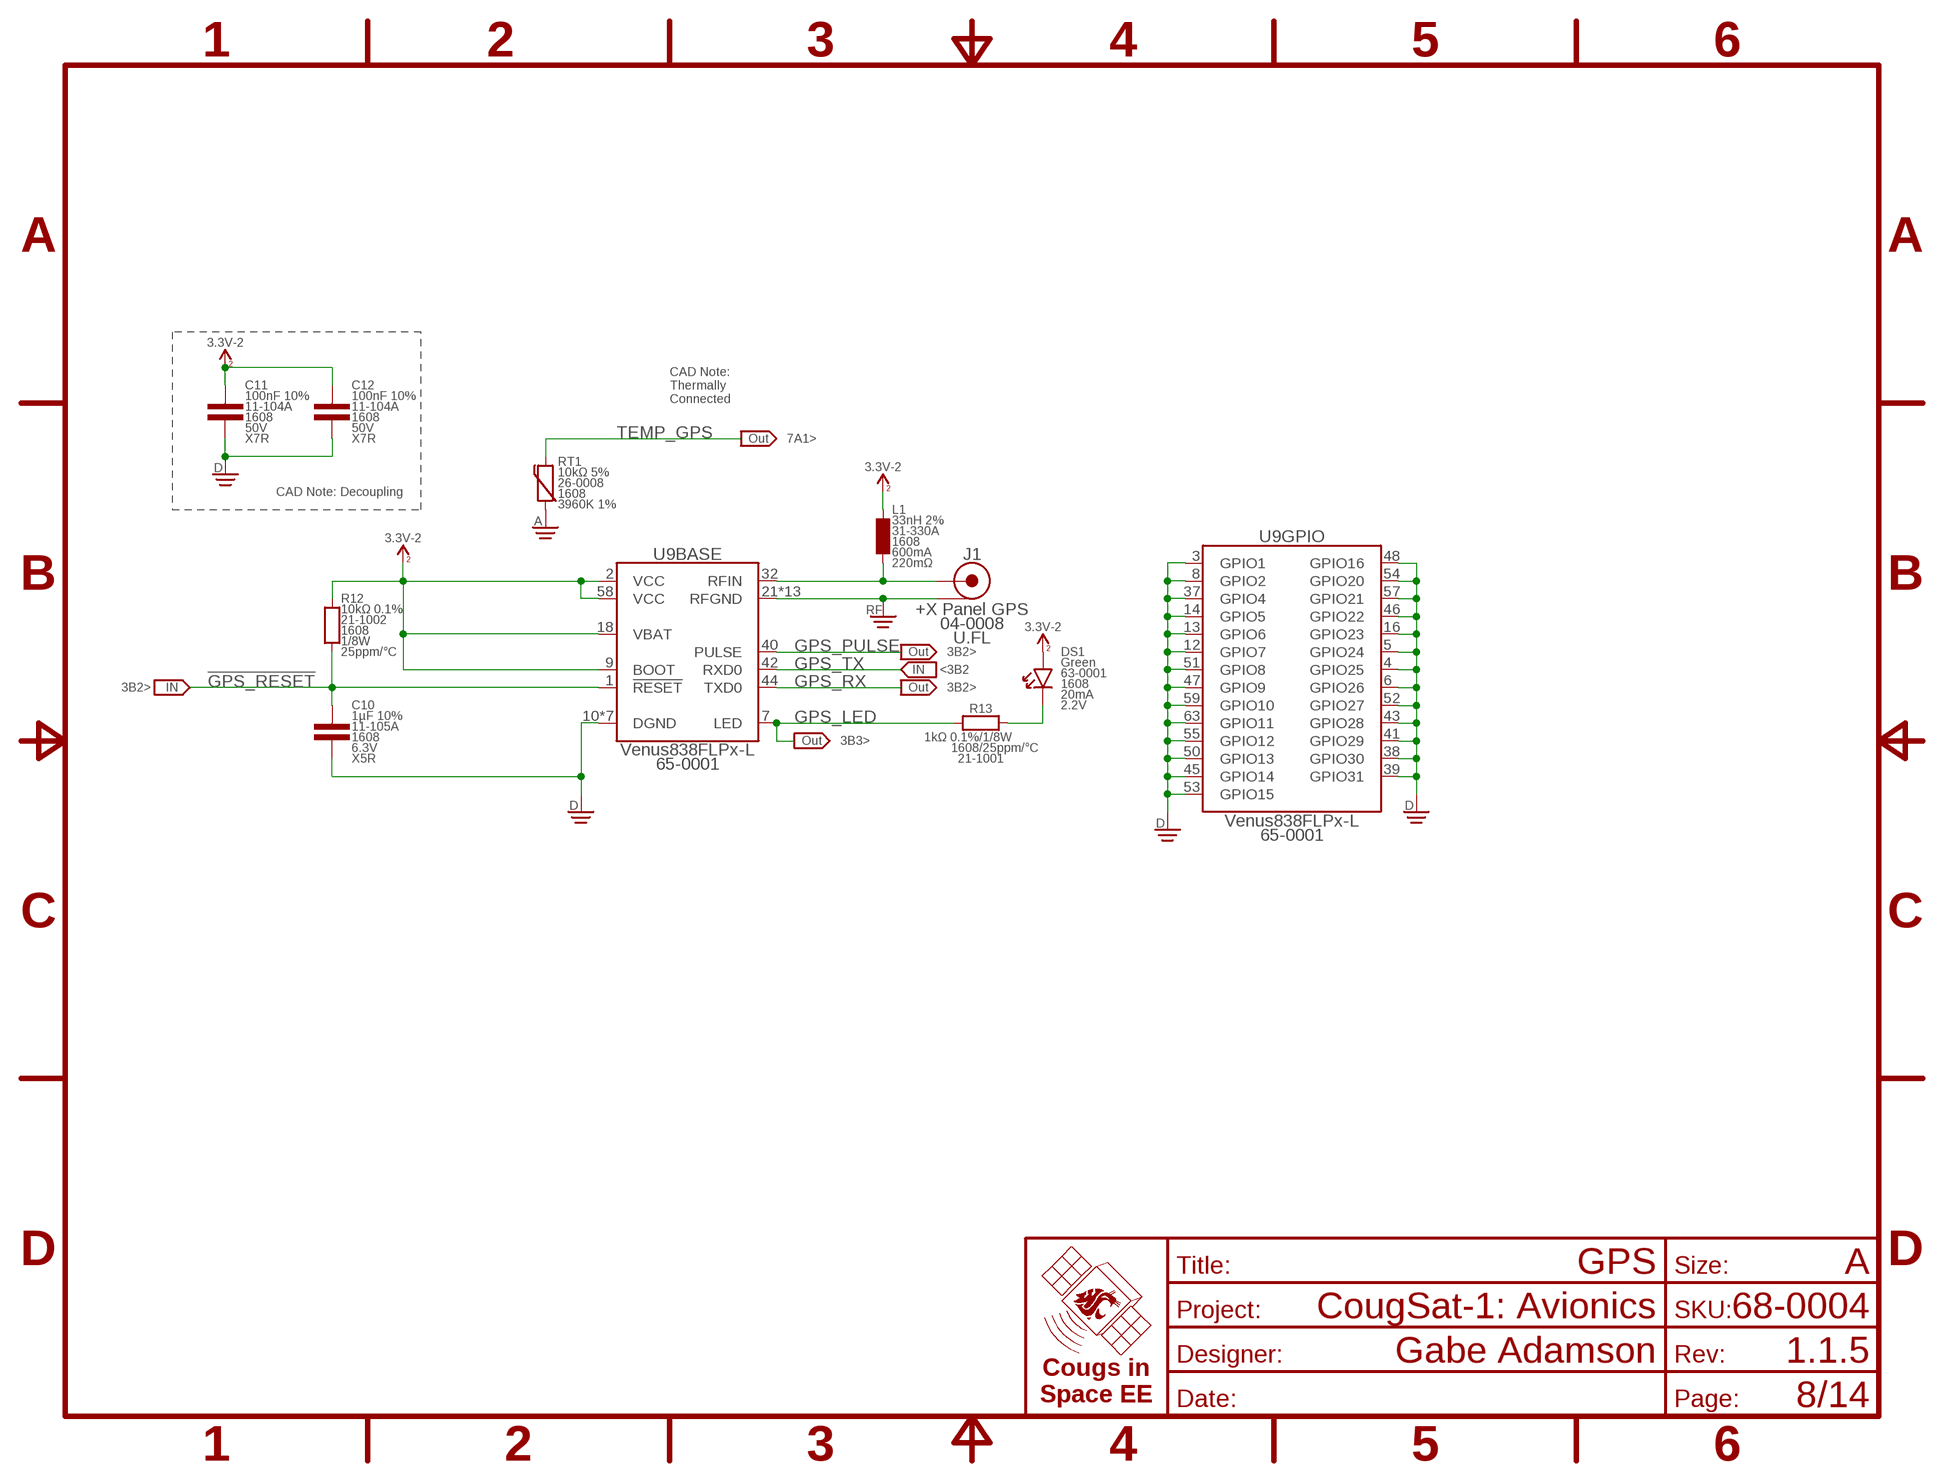
[diagram p7: schematic, sheet 8]
FRAME7 (FRAME-A): TITLE: GPS

### Parts
C10  1µF 10%  CAP-V-1UF-1608  [1608]
C11  100nF 10%  CAP-V-100NF-1608  [1608]
C12  100nF 10%  CAP-V-100NF-1608  [1608]
DS1  Green  LED-V-GRN-1608  [1608-POL]
J1  +X Panel GPS  COAX-U.FL  [U.FL]
L1  33nH 2%  INDUCTOR-V-33NH-1608  [1608]
R12  10kΩ 0.1%  RES-V-10K-1608  [1608]
R13  1kΩ 0.1%  RES-H-1K-1608  [1608]
RT1  10kΩ 5%  THERMISTOR-V-10K-1608  [1608]
U9  Venus838FLPx-L  VENUS838FLPX  [VENUS-1010]

### Nets
3.3V_2 [Power]: C11.1 C12.1 DS1.A L1.2 R12.2 U9.2(BASE:VCC) U9.9(BASE:BOOT) U9.18(BASE:VBAT) U9.58(BASE:VCC) ; supply symbol labelled 3.3V-2 ; also sheet 3,4,5,6,7,13
!GPS_RESET: C10.1 R12.1 U9.1(BASE:!RESET) ; also sheet 3
AGND [Power]: RT1.1 ; also sheet 2,3,5,6,7,9,10,11,12
DGND [Power]: C10.2 C11.2 C12.2 U9.3(GPIO:GPIO1) U9.4(GPIO:GPIO25) U9.5(GPIO:GPIO24) U9.6(GPIO:GPIO26) U9.8(GPIO:GPIO2) U9.10(BASE:DGND) U9.11(BASE:DGND) U9.12(GPIO:GPIO7) U9.13(GPIO:GPIO6) U9.14(GPIO:GPIO5) U9.15(BASE:DGND) U9.16(GPIO:GPIO23) U9.19(BASE:DGND) U9.37(GPIO:GPIO4) U9.38(GPIO:GPIO30) U9.39(GPIO:GPIO31) U9.41(GPIO:GPIO29) U9.43(GPIO:GPIO28) U9.45(GPIO:GPIO14) U9.46(GPIO:GPIO22) U9.47(GPIO:GPIO9) U9.48(GPIO:GPIO16) U9.49(BASE:DGND) U9.50(GPIO:GPIO13) U9.51(GPIO:GPIO8) U9.52(GPIO:GPIO27) U9.53(GPIO:GPIO15) U9.54(GPIO:GPIO20) U9.55(GPIO:GPIO12) U9.57(GPIO:GPIO21) U9.59(GPIO:GPIO10) U9.60(BASE:DGND) U9.63(GPIO:GPIO11) U9.64(BASE:DGND) ; also sheet 2,3,4,6,7,9,10,11,12,13
GPS_LED: R13.1 U9.7(BASE:LED) ; also sheet 3
GPS_LED_DIODE: DS1.C R13.2
GPS_PULSE: U9.40(BASE:PULSE) ; also sheet 3
GPS_RFIN: J1.CENTER L1.1 U9.32(BASE:RFIN)
GPS_RX: U9.44(BASE:TXD0) ; also sheet 3
GPS_TX: U9.42(BASE:RXD0) ; also sheet 3
RFGND [Power]: J1.SHIELD@1(SHIELD) J1.SHIELD@2(SHIELD) J1.SHIELD@13(SHIELD) U9.21(BASE:RFGND) U9.22(BASE:RFGND) U9.24(BASE:RFGND) U9.25(BASE:RFGND) U9.27(BASE:RFGND) U9.28(BASE:RFGND) U9.29(BASE:RFGND) U9.31(BASE:RFGND) U9.33(BASE:RFGND) U9.61(BASE:RFGND) U9.62(BASE:RFGND) U9.65(BASE:RFGND) U9.69(BASE:RFGND) ; also sheet 2
TEMP_GPS: RT1.2 ; also sheet 7

### Notes on the sheet
- CAD Note:
  Thermally
  Connected
- 7A1>
- CAD Note: Decoupling
- 3B2>
- <3B2
- 3B2> | 3B2>
- 3B3>

## Sheet 9 of 14
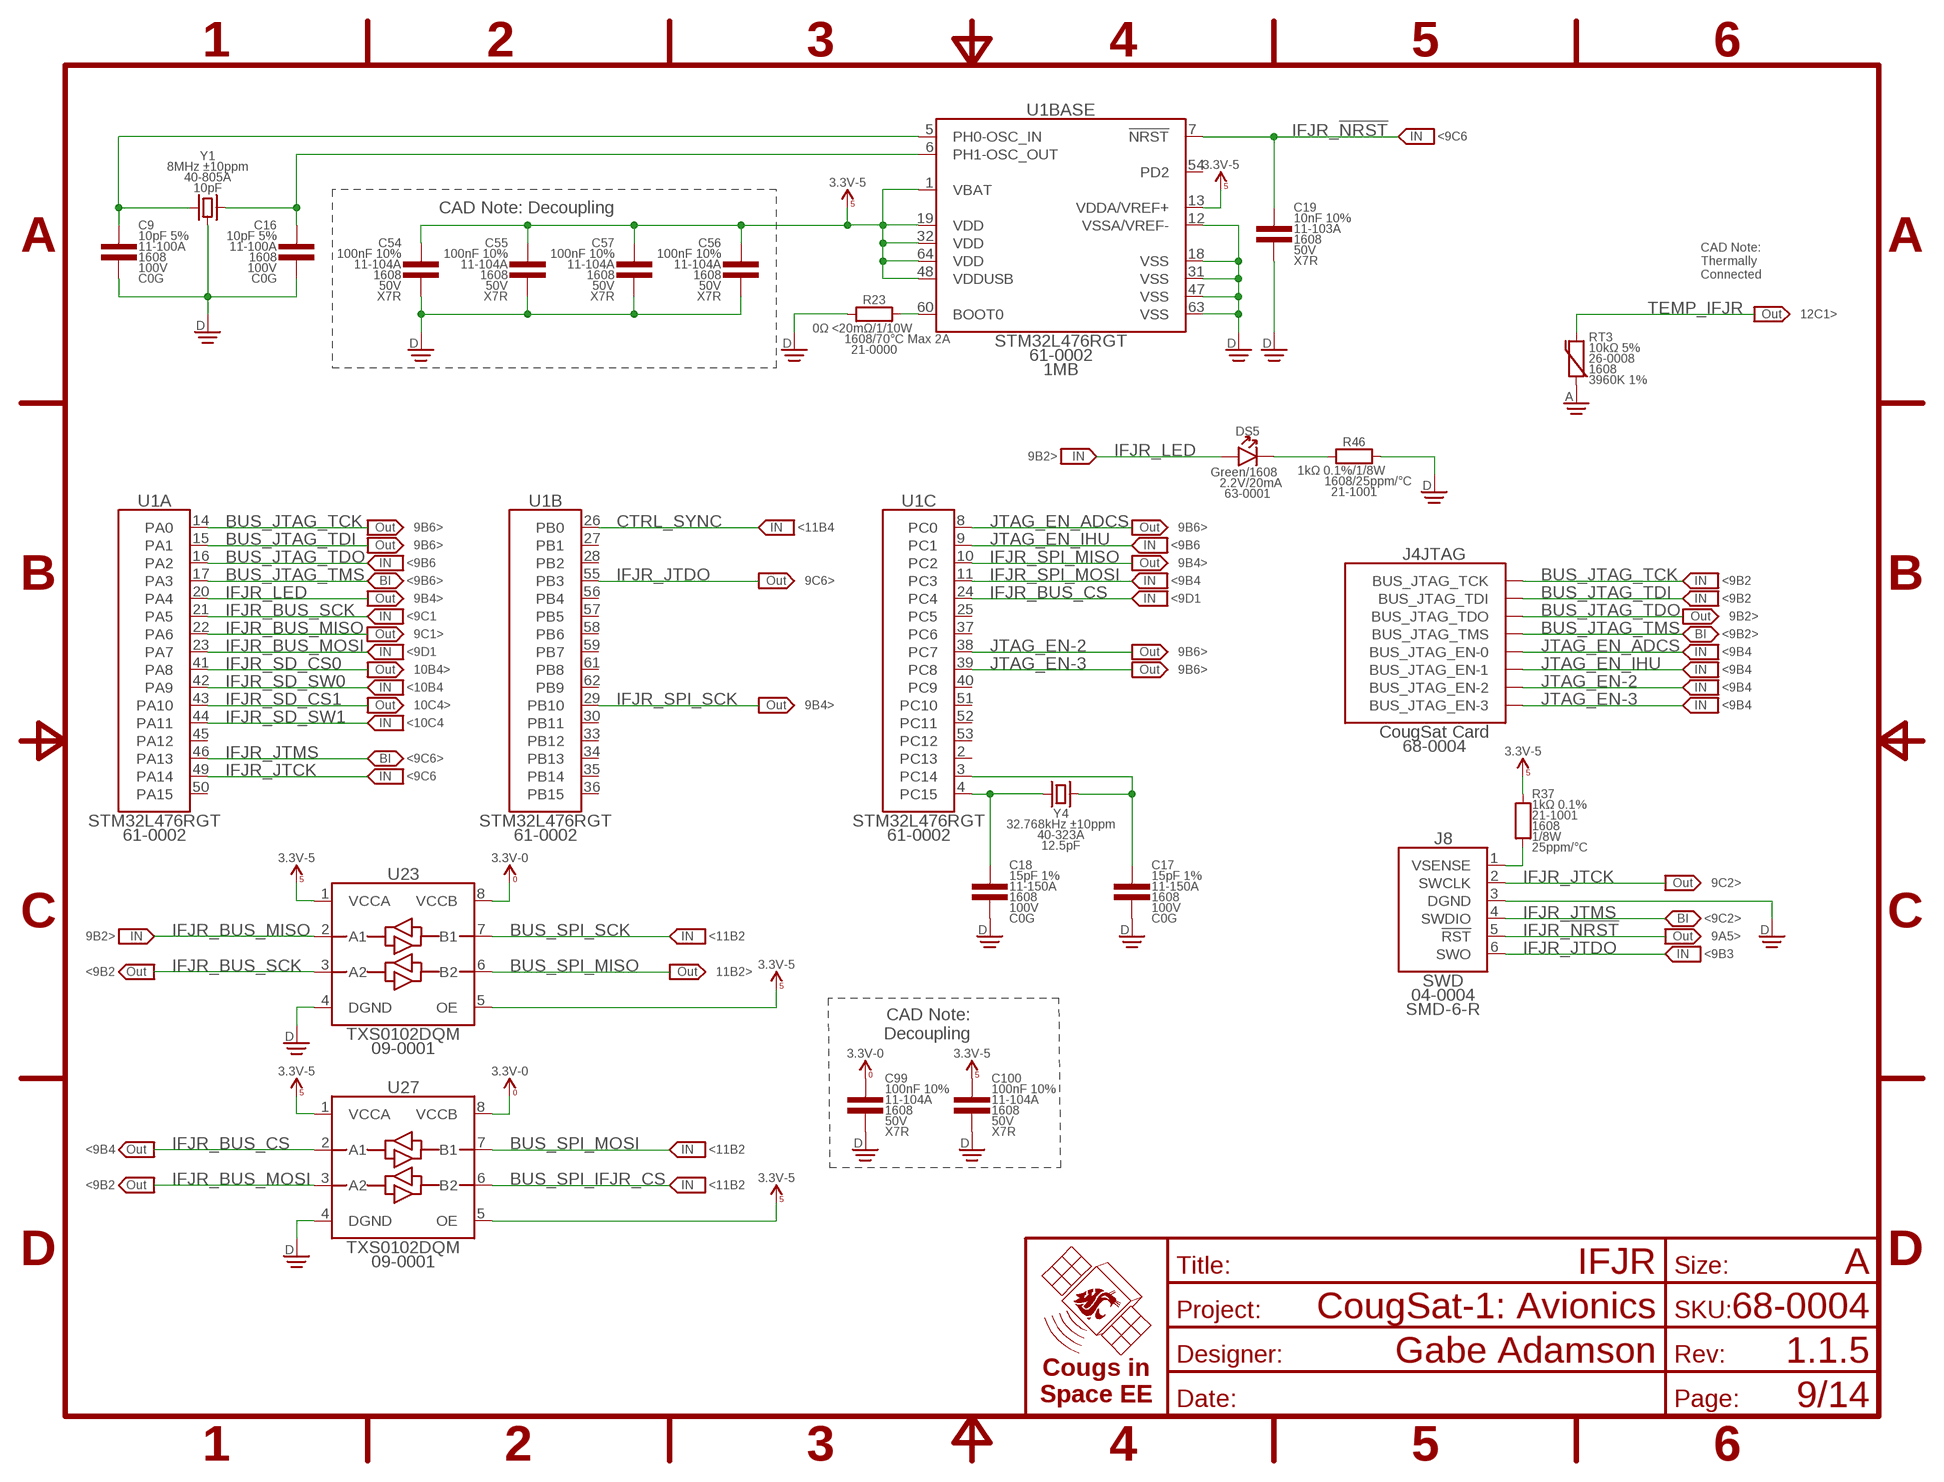
[diagram p8: schematic, sheet 9]
FRAME8 (FRAME-A): TITLE: IFJR

### Parts
C9  10pF 5%  CAP-V-10PF-1608  [1608]
C16  10pF 5%  CAP-V-10PF-1608  [1608]
C17  15pF 1%  CAP-V-15PF-1608  [1608]
C18  15pF 1%  CAP-V-15PF-1608  [1608]
C19  10nF 10%  CAP-V-10NF-1608  [1608]
C54  100nF 10%  CAP-V-100NF-1608  [1608]
C55  100nF 10%  CAP-V-100NF-1608  [1608]
C56  100nF 10%  CAP-V-100NF-1608  [1608]
C57  100nF 10%  CAP-V-100NF-1608  [1608]
C99  100nF 10%  CAP-V-100NF-1608  [1608]
C100  100nF 10%  CAP-V-100NF-1608  [1608]
DS5  Green  LED-H-GRN-1608  [1608-POL]
J4  CougSat Card  CIS_CARD  [CARD-FULL]
J8  SWD  SWDSMD-6-R  [SMD2.54-1X06-R]
R23  0Ω <20mΩ  RES-H-0-1608  [1608]
R37  1kΩ 0.1%  RES-V-1K-1608  [1608]
R46  1kΩ 0.1%  RES-H-1K-1608  [1608]
RT3  10kΩ 5%  THERMISTOR-V-10K-1608  [1608]
U1  STM32L476RGT  STM32-64P-L476RGT  [QFP-64-1010]
U23  TXS0102DQM  LEVEL_SHIFTER-2BIT-XSON-8  [X2SON-8]
U27  TXS0102DQM  LEVEL_SHIFTER-2BIT-XSON-8  [X2SON-8]
Y1  8MHz ±10ppm  CRYSTAL-GROUNDED-8M-SMD-5032  [SMD-5032]
Y4  32.768kHz ±10ppm  CRYSTAL-32.768K-SMD-3215  [SMD-3215]

### Nets
3.3V_0 [Power]: C99.1 U23.8(VCCB) U27.8(VCCB) ; supply symbol labelled 3.3V-0 ; also sheet 3,11,12,13
3.3V_5 [Power]: C54.1 C55.1 C56.1 C57.1 C100.1 R37.2 U1.1(BASE:VBAT) U1.13(BASE:VDDA/VREF+) U1.19(BASE:VDD) U1.32(BASE:VDD) U1.48(BASE:VDDUSB) U1.64(BASE:VDD) U23.1(VCCA) U23.5(OE) U27.1(VCCA) U27.5(OE) ; supply symbol labelled 3.3V-5 ; also sheet 3,10,11,13
AGND [Power]: RT3.1 ; also sheet 2,3,5,6,7,8,10,11,12
BUS_JTAG_TCK: J4.A46(JTAG:BUS_JTAG_TCK) U1.14(A:PA0) ; also sheet 3,11
BUS_JTAG_TDI: J4.A47(JTAG:BUS_JTAG_TDI) U1.15(A:PA1) ; also sheet 3,11
BUS_JTAG_TDO: J4.A48(JTAG:BUS_JTAG_TDO) U1.16(A:PA2) ; also sheet 3,11
BUS_JTAG_TMS: J4.A49(JTAG:BUS_JTAG_TMS) U1.17(A:PA3) ; also sheet 3,11
BUS_SPI_IFJR_CS: U27.6(B2) ; also sheet 11
BUS_SPI_MISO: U23.6(B2) ; also sheet 11
BUS_SPI_MOSI: U27.7(B1) ; also sheet 11
BUS_SPI_SCK: U23.7(B1) ; also sheet 11
CTRL_SYNC: U1.26(B:PB0) ; also sheet 3,11
DGND [Power]: C9.2 C16.2 C17.2 C18.2 C19.2 C54.2 C55.2 C56.2 C57.2 C99.2 C100.2 J8.3(DGND) R23.1 R46.2 U1.12(BASE:VSSA/VREF-) U1.18(BASE:VSS) U1.31(BASE:VSS) U1.47(BASE:VSS) U1.63(BASE:VSS) U23.4(DGND) U27.4(DGND) Y1.2(GND) Y1.4(GND) ; also sheet 2,3,4,6,7,8,10,11,12,13
IFJR_!NRST: C19.1 J8.5(!RST) U1.7(BASE:!NRST)
IFJR_BOOT0: R23.2 U1.60(BASE:BOOT0)
IFJR_BUS_CS: U1.24(C:PC4) U27.2(A1)
IFJR_BUS_MISO: U1.22(A:PA6) U23.2(A1)
IFJR_BUS_MOSI: U1.23(A:PA7) U27.3(A2)
IFJR_BUS_SCK: U1.21(A:PA5) U23.3(A2)
IFJR_JTCK: J8.2(SWCLK) U1.49(A:PA14)
IFJR_JTDO: J8.6(SWO) U1.55(B:PB3)
IFJR_JTMS: J8.4(SWDIO) U1.46(A:PA13)
IFJR_LED: DS5.A U1.20(A:PA4)
IFJR_LED_GND: DS5.C R46.1
IFJR_OSC_32_IN: C18.1 U1.4(C:PC15) Y4.1
IFJR_OSC_32_OUT: C17.1 U1.3(C:PC14) Y4.2
IFJR_OSC_IN: C9.1 U1.5(BASE:PH0-OSC_IN) Y1.1
IFJR_OSC_OUT: C16.1 U1.6(BASE:PH1-OSC_OUT) Y1.3
IFJR_SD_CS0: U1.41(A:PA8) ; also sheet 10
IFJR_SD_CS1: U1.43(A:PA10) ; also sheet 10
IFJR_SD_SW0: U1.42(A:PA9) ; also sheet 10
IFJR_SD_SW1: U1.44(A:PA11) ; also sheet 10
IFJR_SPI_MISO: U1.10(C:PC2) ; also sheet 10
IFJR_SPI_MOSI: U1.11(C:PC3) ; also sheet 10
IFJR_SPI_SCK: U1.29(B:PB10) ; also sheet 10
IFJR_SWD_VSENSE: J8.1(VSENSE) R37.1
JTAG_EN-2: J4.B48(JTAG:BUS_JTAG_EN-2) U1.38(C:PC7)
JTAG_EN-3: J4.B49(JTAG:BUS_JTAG_EN-3) U1.39(C:PC8)
JTAG_EN_ADCS: J4.B46(JTAG:BUS_JTAG_EN-0) U1.8(C:PC0) ; also sheet 3
JTAG_EN_IHU: J4.B47(JTAG:BUS_JTAG_EN-1) U1.9(C:PC1) ; also sheet 11
TEMP_IFJR: RT3.2 ; also sheet 12
Unconnected: U1.2(C:PC13) U1.25(C:PC5) U1.27(B:PB1) U1.28(B:PB2) U1.30(B:PB11) U1.33(B:PB12) U1.34(B:PB13) U1.35(B:PB14) U1.36(B:PB15) U1.37(C:PC6) U1.40(C:PC9) U1.45(A:PA12) U1.50(A:PA15) U1.51(C:PC10) U1.52(C:PC11) U1.53(C:PC12) U1.54(BASE:EXTRA_PIN) U1.56(B:PB4) U1.57(B:PB5) U1.58(B:PB6) U1.59(B:PB7) U1.61(B:PB8) U1.62(B:PB9)

### Notes on the sheet
- <9C6
- CAD Note: Decoupling
- CAD Note:
  Thermally
  Connected
- 12C1>
- 9B2>
- 9B6> | <11B4 | 9B6>
- 9B6> | <9B6
- <9B6 | 9B4>
- <9B6> | 9C6> | <9B4 | <9B2
- 9B4> | <9D1 | <9B2
- <9C1 | 9B2>
- 9C1> | <9B2>
- <9D1 | 9B6> | <9B4
- 10B4> | 9B6> | <9B4
- <10B4 | <9B4
- 10C4> | 9B4> | <9B4
- <10C4
- <9C6>
- <9C6
- 9C2>
- <9C2>
- 9B2> | <11B2 | 9A5>
- <9B3
- <9B2 | 11B2>
- CAD Note:
  Decoupling
- <9B4 | <11B2
- <9B2 | <11B2

## Sheet 10 of 14
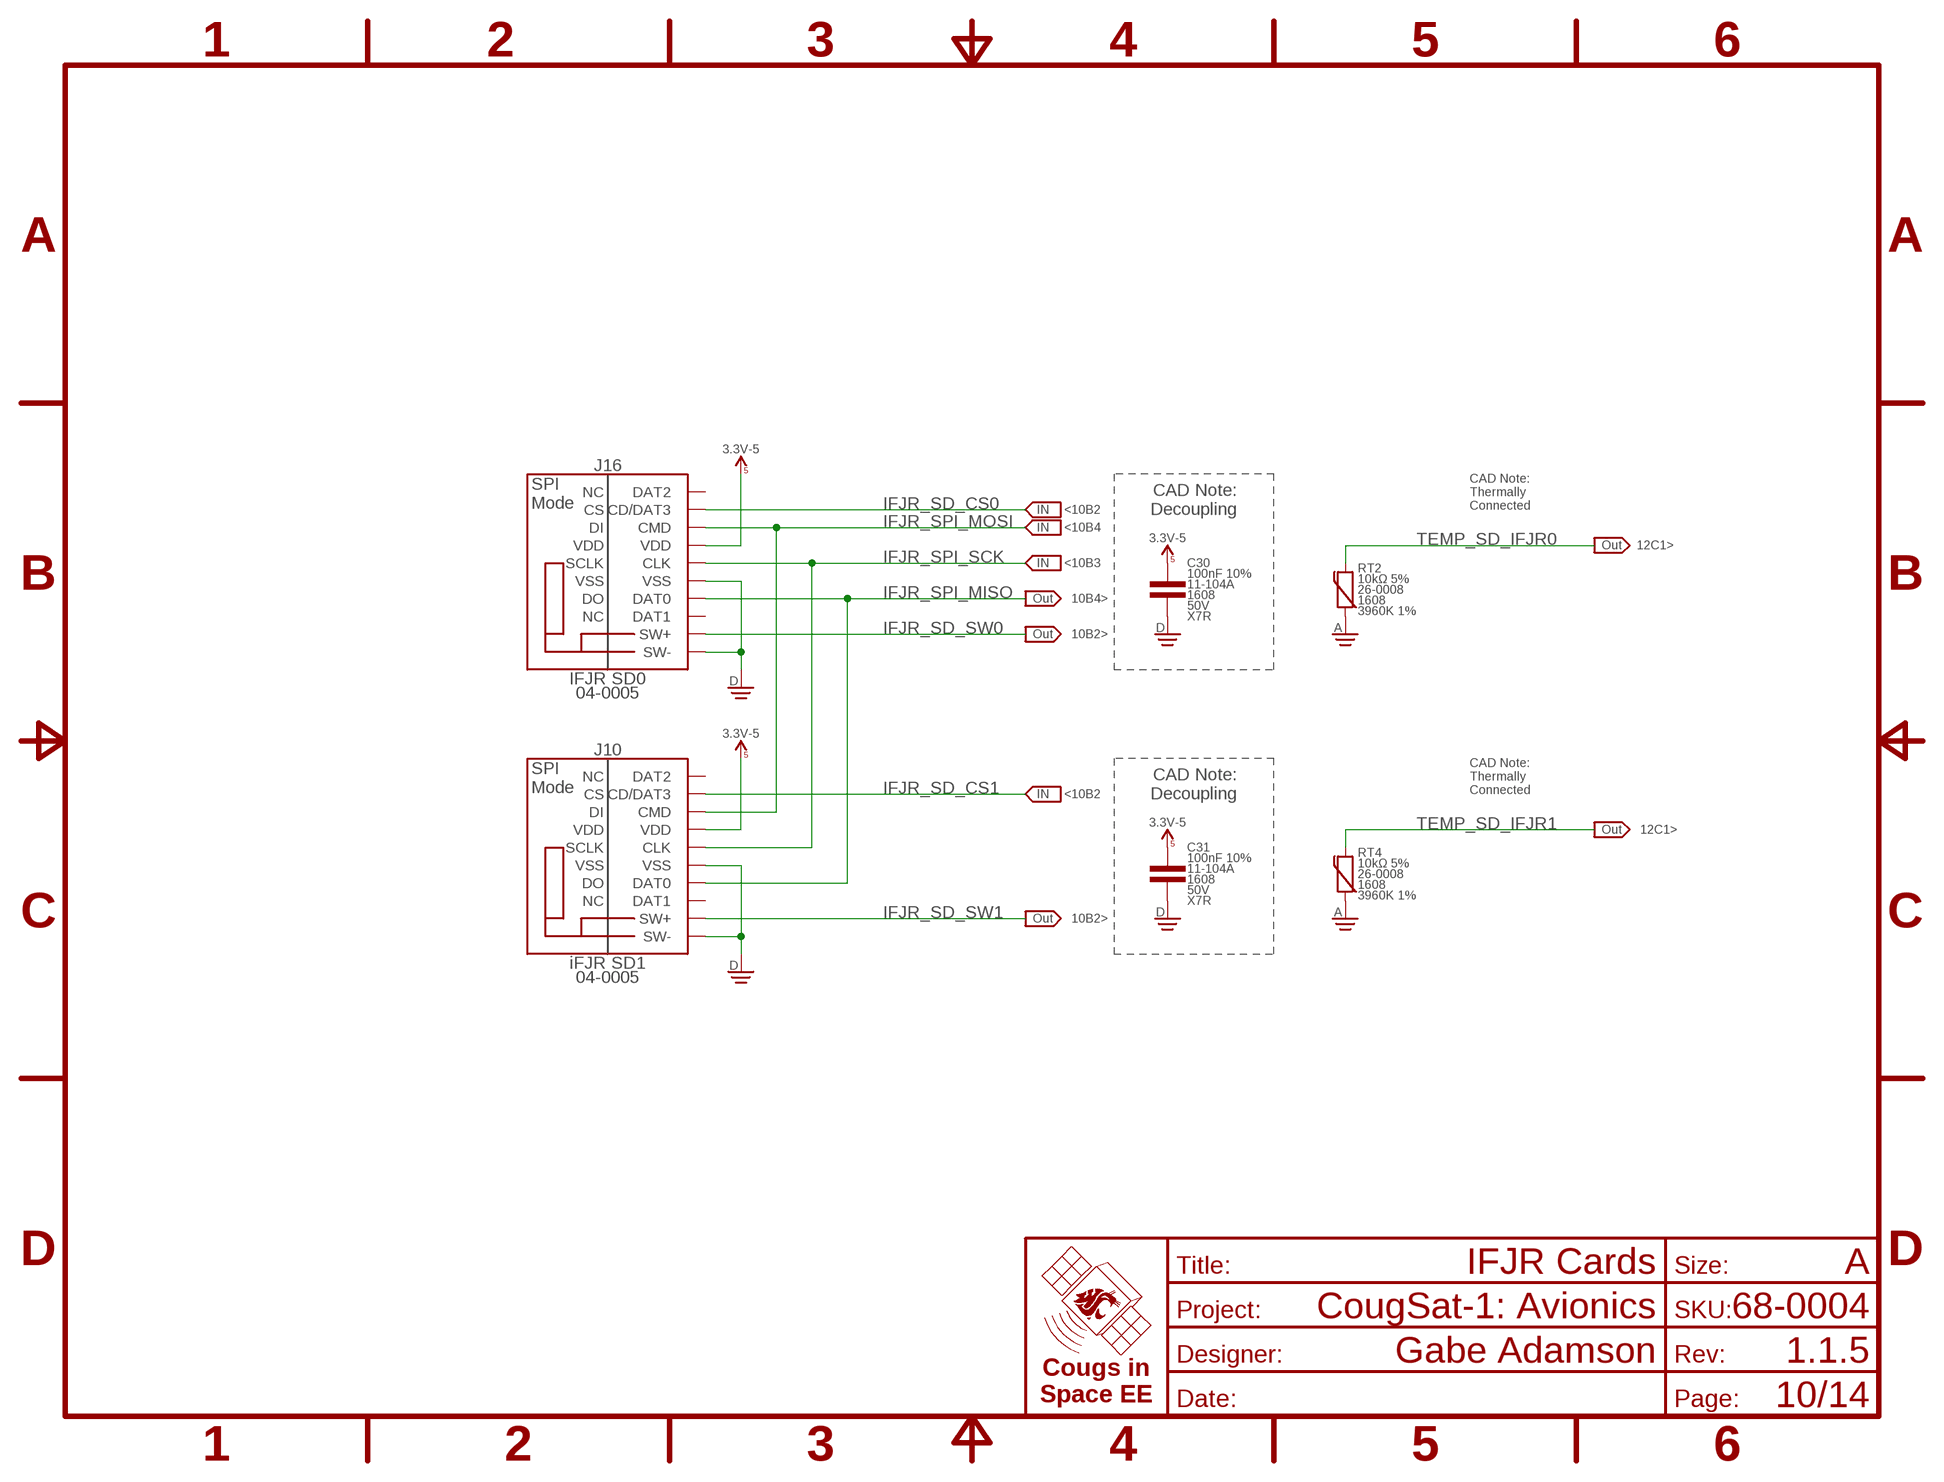
[diagram p9: schematic, sheet 10]
FRAME14 (FRAME-A): TITLE: IFJR Cards

### Parts
C30  100nF 10%  CAP-V-100NF-1608  [1608]
C31  100nF 10%  CAP-V-100NF-1608  [1608]
J10  iFJR SD1  µSD-SW-PUSH-PUSH  [µSD-PUSH-PUSH]
J16  IFJR SD0  µSD-SW-PUSH-PUSH  [µSD-PUSH-PUSH]
RT2  10kΩ 5%  THERMISTOR-V-10K-1608  [1608]
RT4  10kΩ 5%  THERMISTOR-V-10K-1608  [1608]

### Nets
3.3V_5 [Power]: C30.1 C31.1 J10.VDD J16.VDD ; supply symbol labelled 3.3V-5 ; also sheet 3,9,11,13
AGND [Power]: RT2.1 RT4.1 ; also sheet 2,3,5,6,7,8,9,11,12
DGND [Power]: C30.2 C31.2 J10.SW-LEVER(SW-) J10.VSS J16.SW-LEVER(SW-) J16.VSS ; also sheet 2,3,4,6,7,8,9,11,12,13
IFJR_SD_CS0: J16.CD/DAT3 ; also sheet 9
IFJR_SD_CS1: J10.CD/DAT3 ; also sheet 9
IFJR_SD_SW0: J16.SW(SW+) ; also sheet 9
IFJR_SD_SW1: J10.SW(SW+) ; also sheet 9
IFJR_SPI_MISO: J10.DAT0 J16.DAT0 ; also sheet 9
IFJR_SPI_MOSI: J10.CMD J16.CMD ; also sheet 9
IFJR_SPI_SCK: J10.CLK J16.CLK ; also sheet 9
TEMP_SD_IFJR0: RT2.2 ; also sheet 12
TEMP_SD_IFJR1: RT4.2 ; also sheet 12
Unconnected: J10.DAT1 J10.DAT2 J16.DAT1 J16.DAT2

### Notes on the sheet
- CAD Note:
  Thermally
  Connected
- <10B2
- CAD Note:
  Decoupling
- <10B4
- 12C1>
- <10B3
- 10B4>
- 10B2>
- CAD Note:
  Thermally
  Connected
- <10B2
- CAD Note:
  Decoupling
- 12C1>
- 10B2>

## Sheet 11 of 14
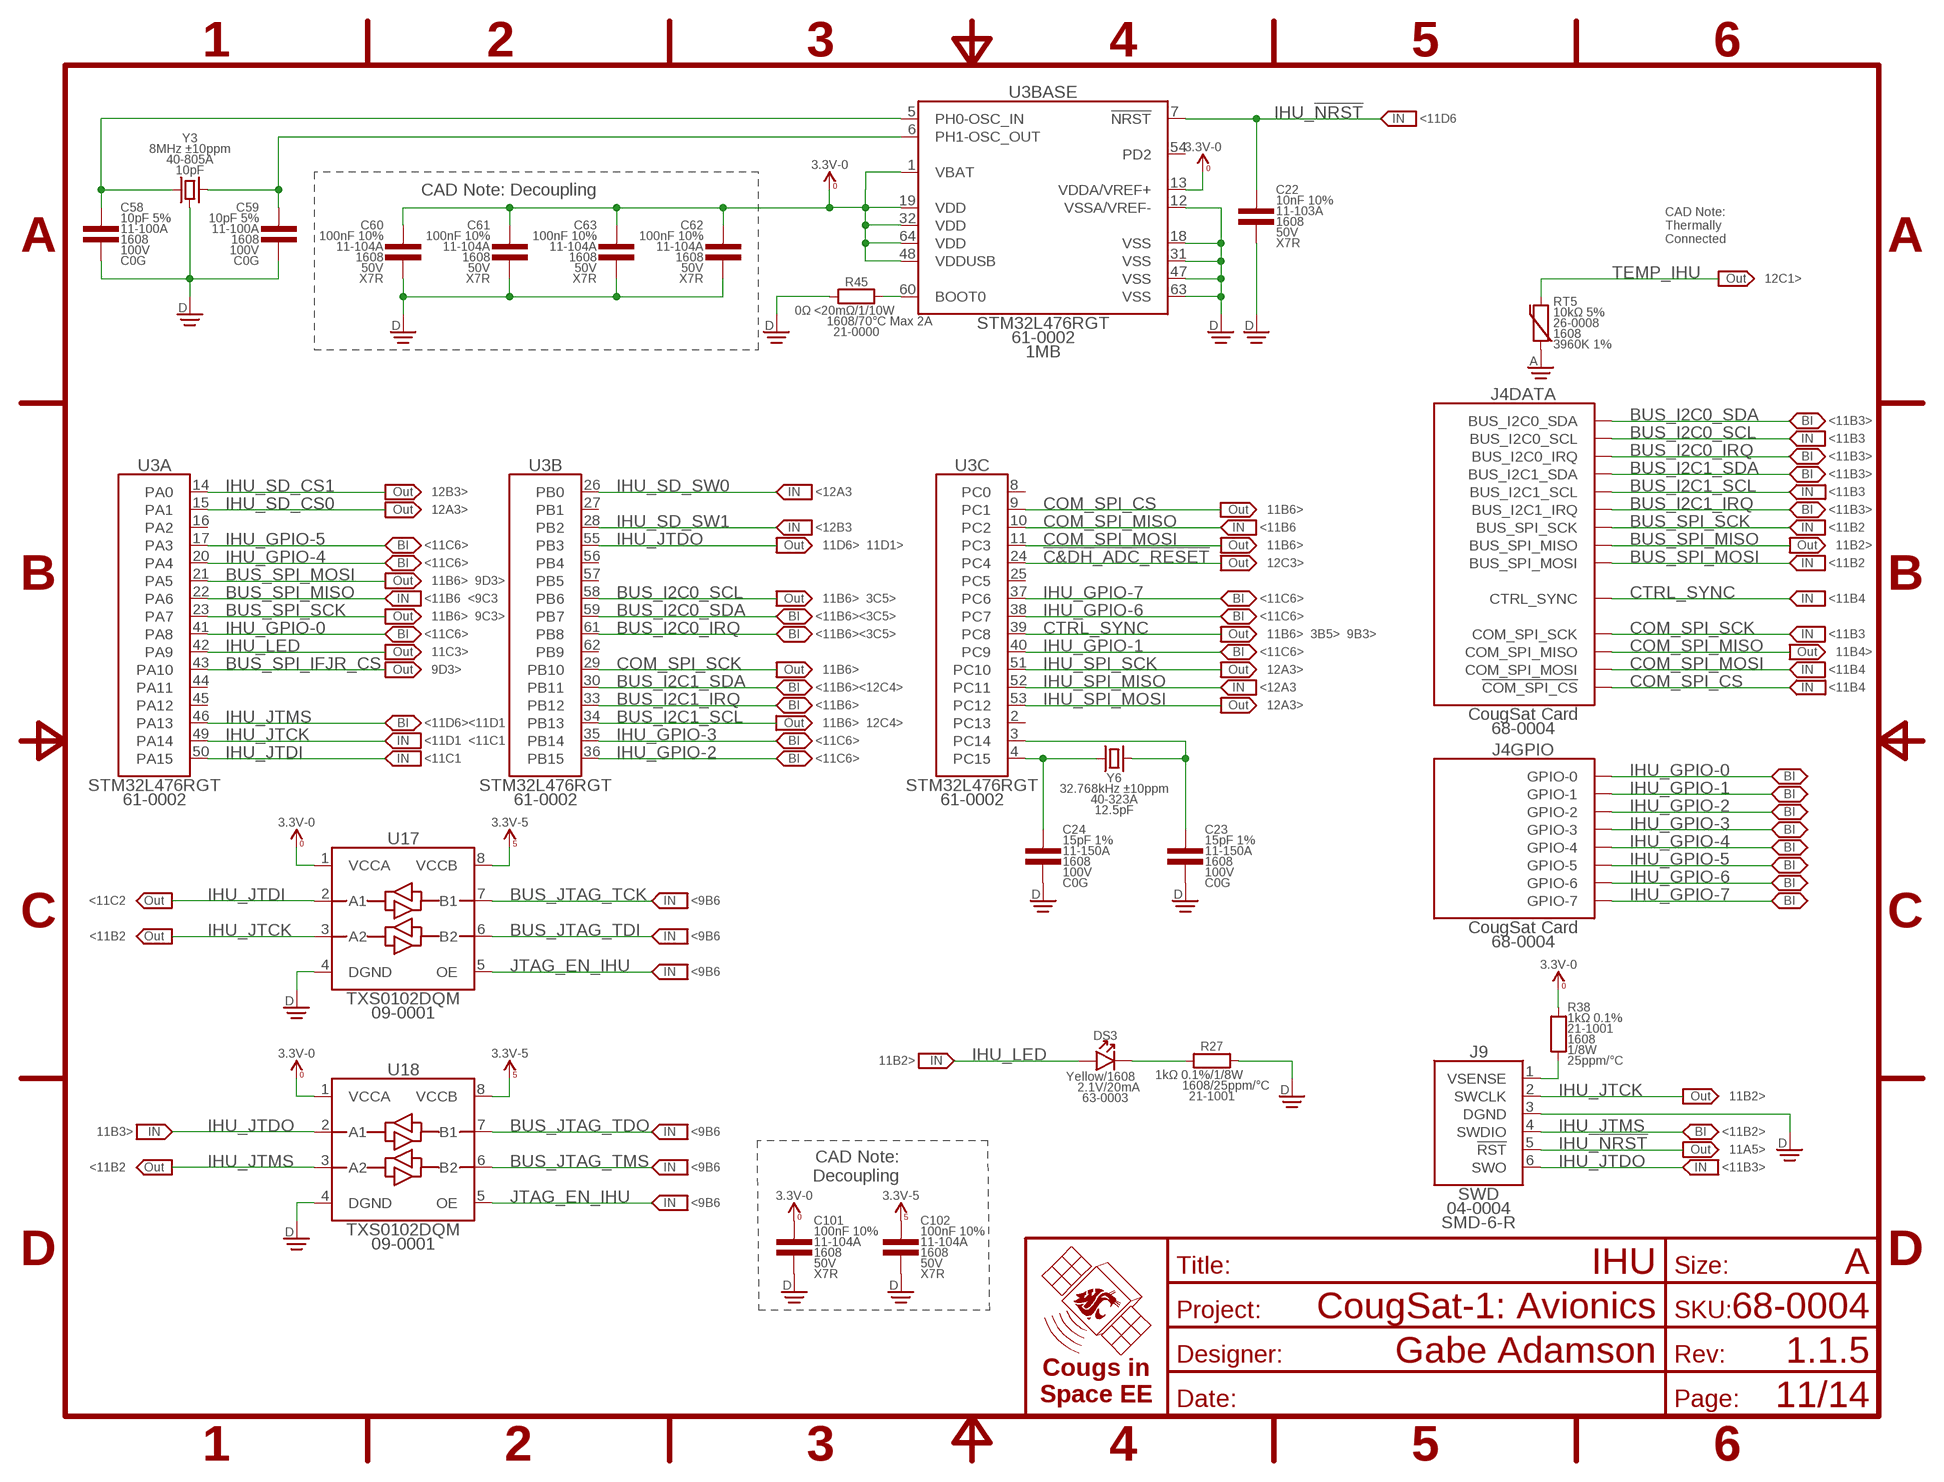
[diagram p10: schematic, sheet 11]
FRAME9 (FRAME-A): TITLE: IHU

### Parts
C22  10nF 10%  CAP-V-10NF-1608  [1608]
C23  15pF 1%  CAP-V-15PF-1608  [1608]
C24  15pF 1%  CAP-V-15PF-1608  [1608]
C58  10pF 5%  CAP-V-10PF-1608  [1608]
C59  10pF 5%  CAP-V-10PF-1608  [1608]
C60  100nF 10%  CAP-V-100NF-1608  [1608]
C61  100nF 10%  CAP-V-100NF-1608  [1608]
C62  100nF 10%  CAP-V-100NF-1608  [1608]
C63  100nF 10%  CAP-V-100NF-1608  [1608]
C101  100nF 10%  CAP-V-100NF-1608  [1608]
C102  100nF 10%  CAP-V-100NF-1608  [1608]
DS3  Yellow  LED-H-YLW-1608  [1608-POL]
J9  SWD  SWDSMD-6-R  [SMD2.54-1X06-R]
R27  1kΩ 0.1%  RES-H-1K-1608  [1608]
R38  1kΩ 0.1%  RES-V-1K-1608  [1608]
R45  0Ω <20mΩ  RES-H-0-1608  [1608]
RT5  10kΩ 5%  THERMISTOR-V-10K-1608  [1608]
U3  STM32L476RGT  STM32-64P-L476RGT  [QFP-64-1010]
U17  TXS0102DQM  LEVEL_SHIFTER-2BIT-XSON-8  [X2SON-8]
U18  TXS0102DQM  LEVEL_SHIFTER-2BIT-XSON-8  [X2SON-8]
Y3  8MHz ±10ppm  CRYSTAL-GROUNDED-8M-SMD-5032  [SMD-5032]
Y6  32.768kHz ±10ppm  CRYSTAL-32.768K-SMD-3215  [SMD-3215]

### Nets
3.3V_0 [Power]: C60.1 C61.1 C62.1 C63.1 C101.1 R38.2 U3.1(BASE:VBAT) U3.13(BASE:VDDA/VREF+) U3.19(BASE:VDD) U3.32(BASE:VDD) U3.48(BASE:VDDUSB) U3.64(BASE:VDD) U17.1(VCCA) U18.1(VCCA) ; supply symbol labelled 3.3V-0 ; also sheet 3,9,12,13
3.3V_5 [Power]: C102.1 U17.8(VCCB) U18.8(VCCB) ; supply symbol labelled 3.3V-5 ; also sheet 3,9,10,13
!C&DH_ADC_RESET: U3.24(C:PC4) ; also sheet 12
AGND [Power]: RT5.1 ; also sheet 2,3,5,6,7,8,9,10,12
BUS_I2C0_IRQ: J4.A45(DATA:BUS_I2C0_IRQ) J4.B45(DATA:BUS_I2C0_IRQ) U3.61(B:PB8) ; also sheet 3
BUS_I2C0_SCL: J4.A44(DATA:BUS_I2C0_SCL) J4.B44(DATA:BUS_I2C0_SCL) U3.58(B:PB6) ; also sheet 3
BUS_I2C0_SDA: J4.A43(DATA:BUS_I2C0_SDA) J4.B43(DATA:BUS_I2C0_SDA) U3.59(B:PB7) ; also sheet 3
BUS_I2C1_IRQ: J4.A32(DATA:BUS_I2C1_IRQ) J4.B32(DATA:BUS_I2C1_IRQ) U3.33(B:PB12)
BUS_I2C1_SCL: J4.A31(DATA:BUS_I2C1_SCL) J4.B31(DATA:BUS_I2C1_SCL) U3.34(B:PB13) ; also sheet 12
BUS_I2C1_SDA: J4.A30(DATA:BUS_I2C1_SDA) J4.B30(DATA:BUS_I2C1_SDA) U3.30(B:PB11) ; also sheet 12
BUS_JTAG_TCK: U17.7(B1) ; also sheet 3,9
BUS_JTAG_TDI: U17.6(B2) ; also sheet 3,9
BUS_JTAG_TDO: U18.7(B1) ; also sheet 3,9
BUS_JTAG_TMS: U18.6(B2) ; also sheet 3,9
BUS_SPI_IFJR_CS: U3.43(A:PA10) ; also sheet 9
BUS_SPI_MISO: J4.A38(DATA:BUS_SPI_MISO) J4.B38(DATA:BUS_SPI_MISO) U3.22(A:PA6) ; also sheet 9
BUS_SPI_MOSI: J4.A39(DATA:BUS_SPI_MOSI) J4.B39(DATA:BUS_SPI_MOSI) U3.21(A:PA5) ; also sheet 9
BUS_SPI_SCK: J4.A37(DATA:BUS_SPI_SCK) J4.B37(DATA:BUS_SPI_SCK) U3.23(A:PA7) ; also sheet 9
COM_SPI_CS: J4.A36(DATA:!COM_SPI_CS) J4.B36(DATA:!COM_SPI_CS) U3.9(C:PC1)
COM_SPI_MISO: J4.A34(DATA:COM_SPI_MISO) J4.B34(DATA:COM_SPI_MISO) U3.10(C:PC2)
COM_SPI_MOSI: J4.A35(DATA:COM_SPI_MOSI) J4.B35(DATA:COM_SPI_MOSI) U3.11(C:PC3)
COM_SPI_SCK: J4.A33(DATA:COM_SPI_SCK) J4.B33(DATA:COM_SPI_SCK) U3.29(B:PB10)
CTRL_SYNC: J4.A42(DATA:CTRL_SYNC) J4.B42(DATA:CTRL_SYNC) U3.39(C:PC8) ; also sheet 3,9
DGND [Power]: C22.2 C23.2 C24.2 C58.2 C59.2 C60.2 C61.2 C62.2 C63.2 C101.2 C102.2 J9.3(DGND) R27.2 R45.1 U3.12(BASE:VSSA/VREF-) U3.18(BASE:VSS) U3.31(BASE:VSS) U3.47(BASE:VSS) U3.63(BASE:VSS) U17.4(DGND) U18.4(DGND) Y3.2(GND) Y3.4(GND) ; also sheet 2,3,4,6,7,8,9,10,12,13
IHU_!NRST: C22.1 J9.5(!RST) U3.7(BASE:!NRST)
IHU_BOOT0: R45.2 U3.60(BASE:BOOT0)
IHU_GPIO-0: J4.A24(GPIO:GPIO-0) U3.41(A:PA8)
IHU_GPIO-1: J4.A25(GPIO:GPIO-1) U3.40(C:PC9)
IHU_GPIO-2: J4.A26(GPIO:GPIO-2) U3.36(B:PB15)
IHU_GPIO-3: J4.A27(GPIO:GPIO-3) U3.35(B:PB14)
IHU_GPIO-4: J4.A28(GPIO:GPIO-4) U3.20(A:PA4)
IHU_GPIO-5: J4.A29(GPIO:GPIO-5) U3.17(A:PA3)
IHU_GPIO-6: J4.A41(GPIO:GPIO-6) U3.38(C:PC7)
IHU_GPIO-7: J4.B41(GPIO:GPIO-7) U3.37(C:PC6)
IHU_JTCK: J9.2(SWCLK) U3.49(A:PA14) U17.3(A2)
IHU_JTDI: U3.50(A:PA15) U17.2(A1)
IHU_JTDO: J9.6(SWO) U3.55(B:PB3) U18.2(A1)
IHU_JTMS: J9.4(SWDIO) U3.46(A:PA13) U18.3(A2)
IHU_LED: DS3.A U3.42(A:PA9)
IHU_LED_GND: DS3.C R27.1
IHU_OSC_32_IN: C24.1 U3.4(C:PC15) Y6.1
IHU_OSC_32_OUT: C23.1 U3.3(C:PC14) Y6.2
IHU_OSC_IN: C58.1 U3.5(BASE:PH0-OSC_IN) Y3.1
IHU_OSC_OUT: C59.1 U3.6(BASE:PH1-OSC_OUT) Y3.3
IHU_SD_CS0: U3.15(A:PA1) ; also sheet 12
IHU_SD_CS1: U3.14(A:PA0) ; also sheet 12
IHU_SD_SW0: U3.26(B:PB0) ; also sheet 12
IHU_SD_SW1: U3.28(B:PB2) ; also sheet 12
IHU_SPI_MISO: U3.52(C:PC11) ; also sheet 12
IHU_SPI_MOSI: U3.53(C:PC12) ; also sheet 12
IHU_SPI_SCK: U3.51(C:PC10) ; also sheet 12
IHU_SWD_VSENSE: J9.1(VSENSE) R38.1
JTAG_EN_IHU: U17.5(OE) U18.5(OE) ; also sheet 9
TEMP_IHU: RT5.2 ; also sheet 12
Unconnected: U3.2(C:PC13) U3.8(C:PC0) U3.16(A:PA2) U3.25(C:PC5) U3.27(B:PB1) U3.44(A:PA11) U3.45(A:PA12) U3.54(BASE:EXTRA_PIN) U3.56(B:PB4) U3.57(B:PB5) U3.62(B:PB9)

### Notes on the sheet
- <11D6
- CAD Note: Decoupling
- CAD Note:
  Thermally
  Connected
- 12C1>
- <11B3>
- <11B3
- <11B3>
- <11B3>
- 12B3> | <12A3 | <11B3
- 12A3> | 11B6> | <11B3>
- <12B3 | <11B6 | <11B2
- <11C6> | 11D6>  11D1> | 11B6> | 11B2>
- <11C6> | 12C3> | <11B2
- 11B6>  9D3>
- <11B6  <9C3 | 11B6>  3C5> | <11C6> | <11B4
- 11B6>  9C3> | <11B6><3C5> | <11C6>
- <11C6> | <11B6><3C5> | 11B6>  3B5>  9B3> | <11B3
- 11C3> | <11C6> | 11B4>
- 9D3> | 11B6> | 12A3> | <11B4
- <11B6><12C4> | <12A3 | <11B4
- <11B6> | 12A3>
- <11D6><11D1 | 11B6>  12C4>
- <11D1  <11C1 | <11C6>
- <11C1 | <11C6>
- <11C2 | <9B6
- <11B2 | <9B6
- <9B6
- 11B2>
- 11B2>
- 11B3> | <9B6 | <11B2>
- 11A5>
- <11B2 | <9B6 | <11B3>
- CAD Note:
  Decoupling
- <9B6

## Sheet 12 of 14
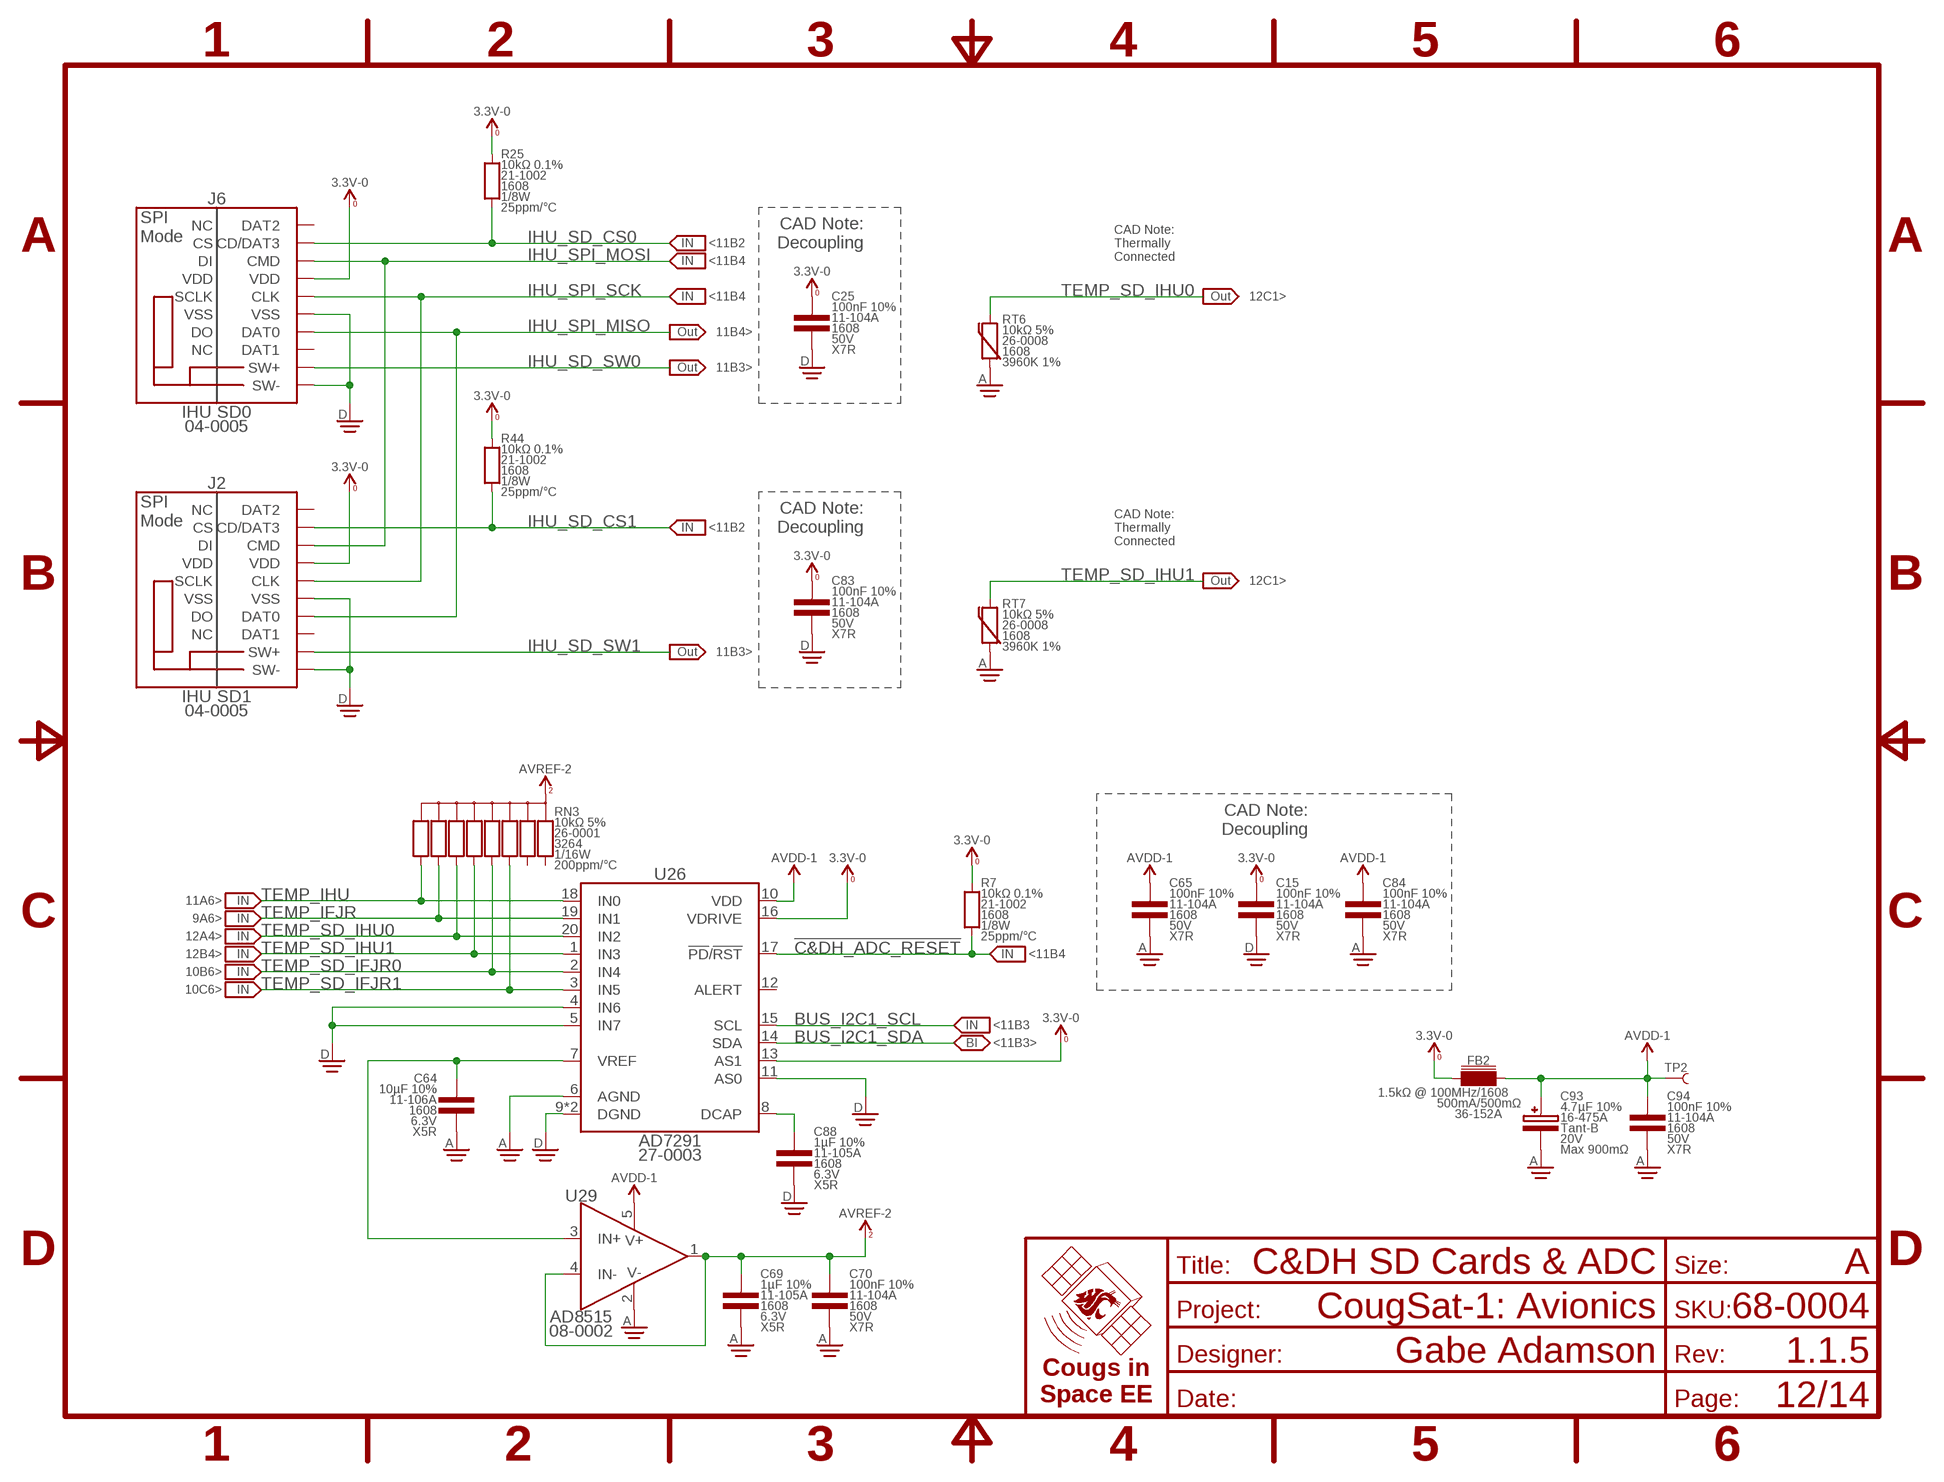
[diagram p11: schematic, sheet 12]
FRAME12 (FRAME-A): TITLE: C&DH SD Cards & ADC

### Parts
C15  100nF 10%  CAP-V-100NF-1608  [1608]
C25  100nF 10%  CAP-V-100NF-1608  [1608]
C64  10µF 10%  CAP-V-10UF-1608  [1608]
C65  100nF 10%  CAP-V-100NF-1608  [1608]
C69  1µF 10%  CAP-V-1UF-1608  [1608]
C70  100nF 10%  CAP-V-100NF-1608  [1608]
C83  100nF 10%  CAP-V-100NF-1608  [1608]
C84  100nF 10%  CAP-V-100NF-1608  [1608]
C88  1µF 10%  CAP-V-1UF-1608  [1608]
C93  4.7µF 10%  CAP-POL-V-4.7UF-4028  [4028-POL]
C94  100nF 10%  CAP-V-100NF-1608  [1608]
FB2  1.5kΩ @ 100MHz  CHOKE-H-1.5K-1608  [1608]
J2  IHU SD1  µSD-SW-PUSH-PUSH  [µSD-PUSH-PUSH]
J6  IHU SD0  µSD-SW-PUSH-PUSH  [µSD-PUSH-PUSH]
R7  10kΩ 0.1%  RES-V-10K-1608  [1608]
R25  10kΩ 0.1%  RES-V-10K-1608  [1608]
R44  10kΩ 0.1%  RES-V-10K-1608  [1608]
RN3  10kΩ 5%  RES_BUS-10-10K-3264  [3264]
RT6  10kΩ 5%  THERMISTOR-V-10K-1608  [1608]
RT7  10kΩ 5%  THERMISTOR-V-10K-1608  [1608]
TP2  TEST_POINT-SMD-C-1.25  [SMD-C-1.25]
U26  AD7291  [QFN-20-4040]
U29  AD8515  OPAMP-1-AD8515  [SOT23-5]

### Nets
3.3V_0 [Power]: C15.1 C25.1 C83.1 FB2.1 J2.VDD J6.VDD R7.2 R25.2 R44.2 U26.13(AS1) U26.16(VDRIVE) ; supply symbol labelled 3.3V-0 ; also sheet 3,9,11,13
!C&DH_ADC_RESET: R7.1 U26.17(!PD!/!RST) ; also sheet 11
AGND [Power]: C64.2 C65.2 C69.2 C70.2 C84.2 C93.C C94.2 RT6.1 RT7.1 U26.6(AGND) U29.2(V-) ; also sheet 2,3,5,6,7,8,9,10,11
AVDD-1 [Power]: C65.1 C84.1 C93.A C94.1 FB2.2 TP2.1 U26.10(VDD) U29.5(V+)
AVREF-2: C69.1 C70.1 RN3.5(C) RN3.10(C) U29.1(OUT) U29.4(IN-)
BUS_I2C1_SCL: U26.15(SCL) ; also sheet 11
BUS_I2C1_SDA: U26.14(SDA) ; also sheet 11
C&DH_ADC_DCAP: C88.1 U26.8(DCAP)
C&DH_ADC_VREF: C64.1 U26.7(VREF) U29.3(IN+)
DGND [Power]: C15.2 C25.2 C83.2 C88.2 J2.SW-LEVER(SW-) J2.VSS J6.SW-LEVER(SW-) J6.VSS U26.4(IN6) U26.5(IN7) U26.9(DGND) U26.11(AS0) U26.PAD(DGND) ; also sheet 2,3,4,6,7,8,9,10,11,13
IHU_SD_CS0: J6.CD/DAT3 R25.1 ; also sheet 11
IHU_SD_CS1: J2.CD/DAT3 R44.1 ; also sheet 11
IHU_SD_SW0: J6.SW(SW+) ; also sheet 11
IHU_SD_SW1: J2.SW(SW+) ; also sheet 11
IHU_SPI_MISO: J2.DAT0 J6.DAT0 ; also sheet 11
IHU_SPI_MOSI: J2.CMD J6.CMD ; also sheet 11
IHU_SPI_SCK: J2.CLK J6.CLK ; also sheet 11
TEMP_IFJR: RN3.8 U26.19(IN1) ; also sheet 9
TEMP_IHU: RN3.9 U26.18(IN0) ; also sheet 11
TEMP_SD_IFJR0: RN3.4 U26.2(IN4) ; also sheet 10
TEMP_SD_IFJR1: RN3.3 U26.3(IN5) ; also sheet 10
TEMP_SD_IHU0: RN3.7 RT6.2 U26.20(IN2)
TEMP_SD_IHU1: RN3.6 RT7.2 U26.1(IN3)
Unconnected: J2.DAT1 J2.DAT2 J6.DAT1 J6.DAT2 RN3.1 RN3.2 U26.12(ALERT)

### Notes on the sheet
- <11B2
- CAD Note:
  Thermally
  Connected
- CAD Note:
  Decoupling
- <11B4
- <11B4 | 12C1>
- 11B4>
- 11B3>
- <11B2
- CAD Note:
  Thermally
  Connected
- CAD Note:
  Decoupling
- 12C1>
- 11B3>
- CAD Note:
  Decoupling
- 11A6>
- 9A6>
- 12A4>
- 12B4> | <11B4
- 10B6>
- 10C6>
- <11B3
- <11B3>

## Sheet 13 of 14
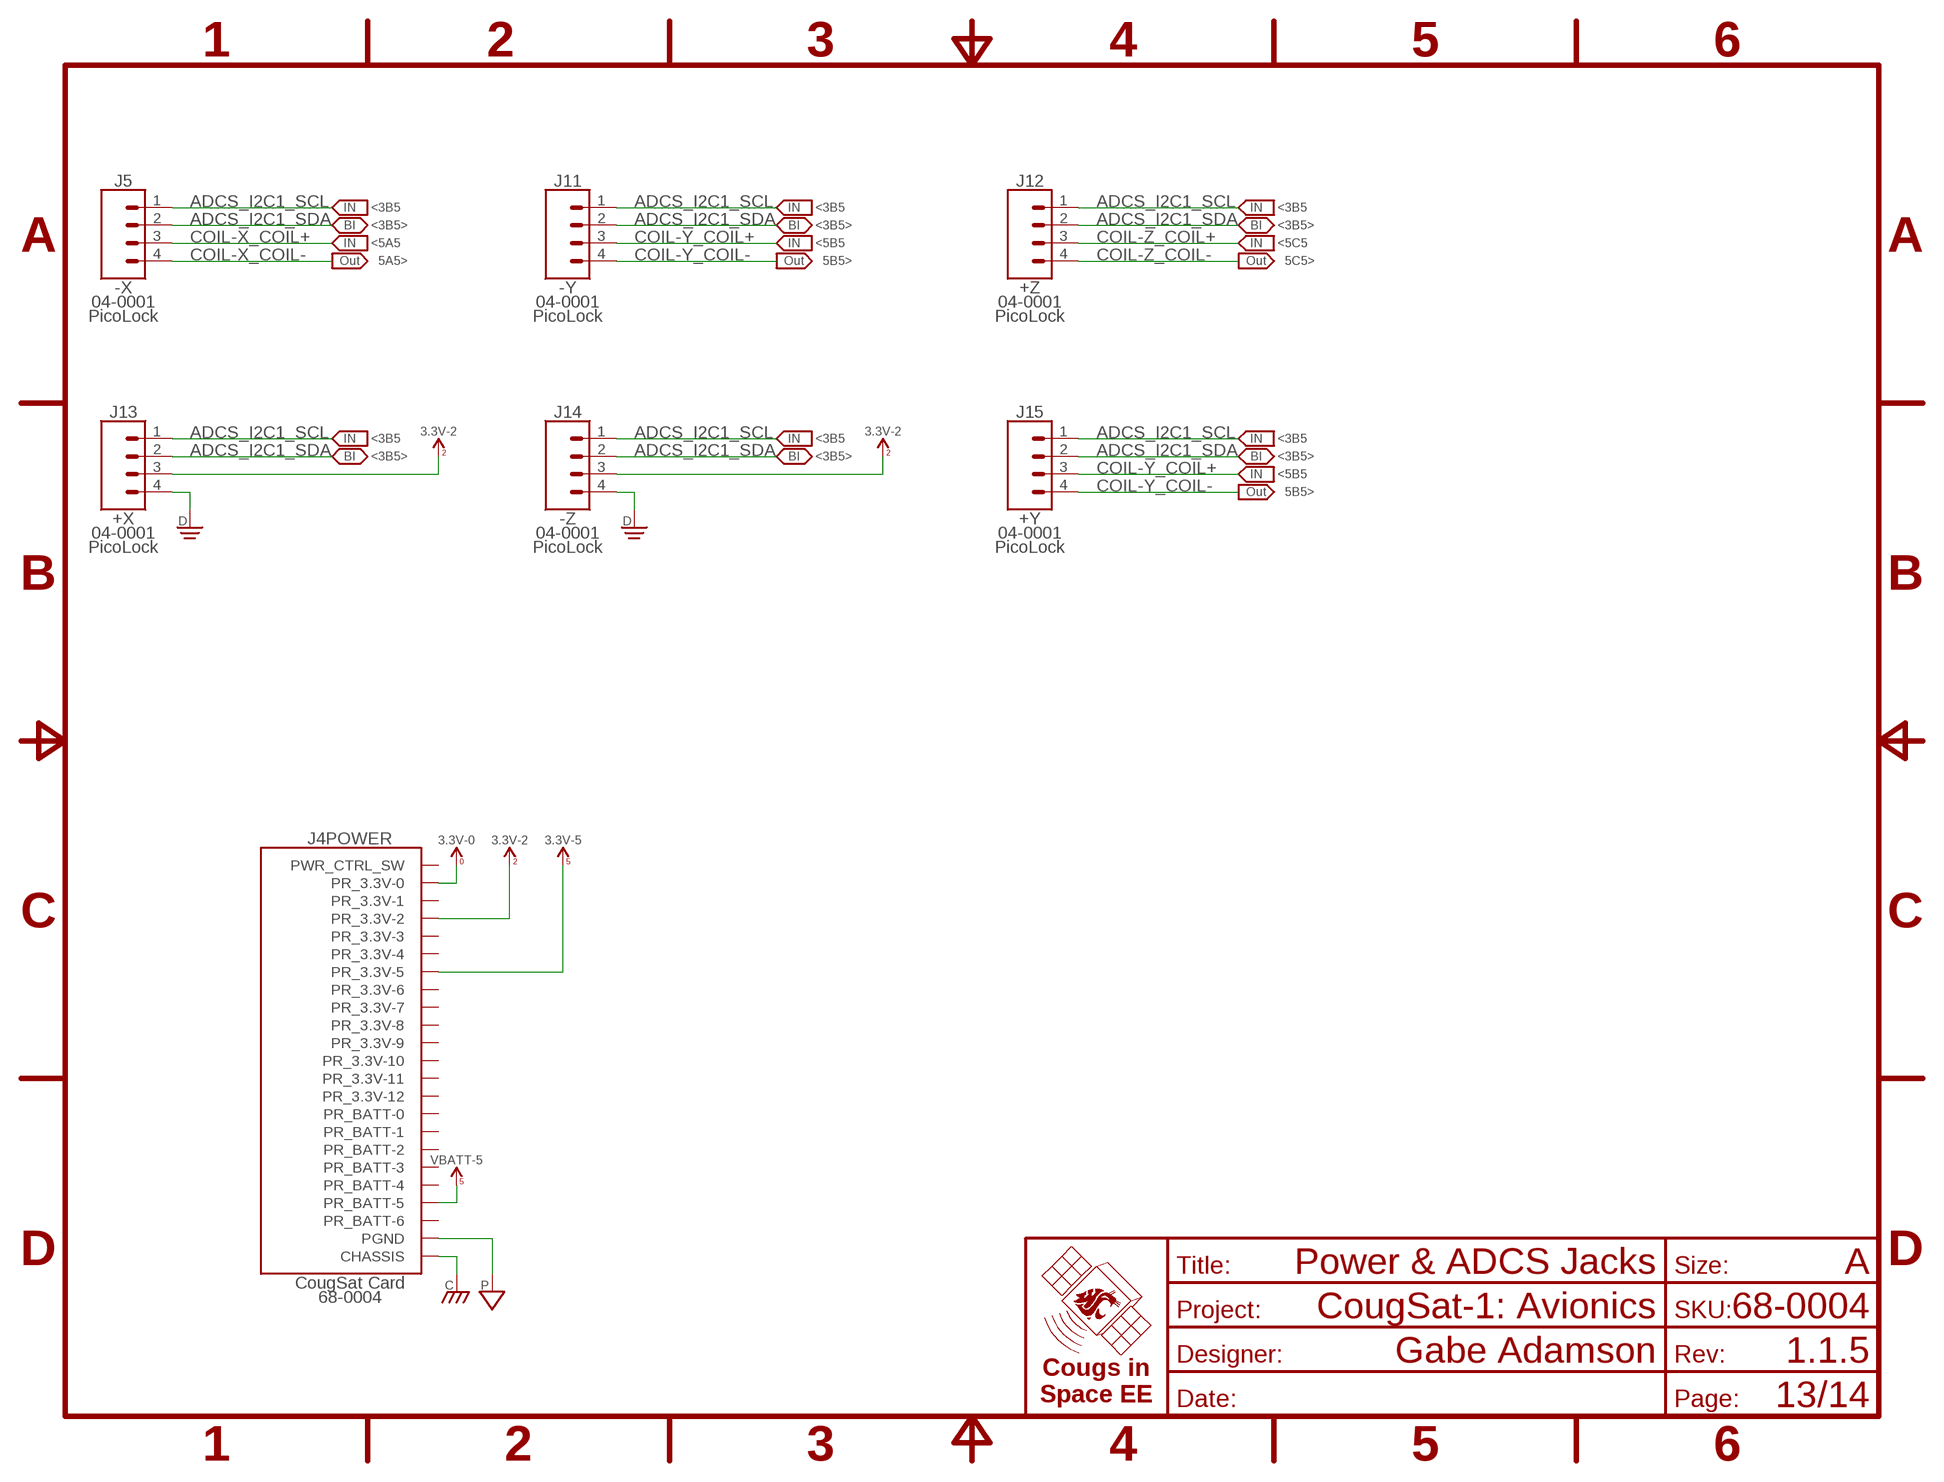
[diagram p12: schematic, sheet 13]
FRAME10 (FRAME-A): TITLE: Power & ADCS Jacks

### Parts
J5  -X  1X04-PICOLOCK  [PICOLOCK1.5-04]
J11  -Y  1X04-PICOLOCK  [PICOLOCK1.5-04]
J12  +Z  1X04-PICOLOCK  [PICOLOCK1.5-04]
J13  +X  1X04-PICOLOCK  [PICOLOCK1.5-04]
J14  -Z  1X04-PICOLOCK  [PICOLOCK1.5-04]
J15  +Y  1X04-PICOLOCK  [PICOLOCK1.5-04]

### Nets
3.3V_0 [Power]: J4.A1(POWER:PR_3.3V-0) J4.B1(POWER:PR_3.3V-0) ; supply symbol labelled 3.3V-0 ; also sheet 3,9,11,12
3.3V_2 [Power]: J4.A3(POWER:PR_3.3V-2) J4.B3(POWER:PR_3.3V-2) J13.3 J14.3 ; supply symbol labelled 3.3V-2 ; also sheet 3,4,5,6,7,8
3.3V_5 [Power]: J4.A6(POWER:PR_3.3V-5) J4.B6(POWER:PR_3.3V-5) ; supply symbol labelled 3.3V-5 ; also sheet 3,9,10,11
ADCS_I2C1_SCL: J5.1 J11.1 J12.1 J13.1 J14.1 J15.1 ; also sheet 3,6
ADCS_I2C1_SDA: J5.2 J11.2 J12.2 J13.2 J14.2 J15.2 ; also sheet 3,6
CHASSIS [Power]: J4.CHASSIS@1(POWER:CHASSIS) J4.CHASSIS@2(POWER:CHASSIS) J4.CHASSIS@3(POWER:CHASSIS) J4.CHASSIS@4(POWER:CHASSIS) ; also sheet 2
COIL-X_COIL+: J5.3 ; also sheet 5
COIL-X_COIL-: J5.4 ; also sheet 5
COIL-Y_COIL+: J11.3 J15.3 ; also sheet 5
COIL-Y_COIL-: J11.4 J15.4 ; also sheet 5
COIL-Z_COIL+: J12.3 ; also sheet 5
COIL-Z_COIL-: J12.4 ; also sheet 5
DGND [Power]: J13.4 J14.4 ; also sheet 2,3,4,6,7,8,9,10,11,12
PGND [Power]: J4.A21(POWER:PGND) J4.A22(POWER:PGND) J4.A23(POWER:PGND) J4.B21(POWER:PGND) J4.B22(POWER:PGND) J4.B23(POWER:PGND) J4.B24(POWER:PGND) J4.B25(POWER:PGND) J4.B26(POWER:PGND) J4.B27(POWER:PGND) J4.B28(POWER:PGND) J4.B29(POWER:PGND) ; also sheet 2,5
VBATT_5 [Power]: J4.A19(POWER:PR_BATT-5) J4.B19(POWER:PR_BATT-5) ; supply symbol labelled VBATT-5 ; also sheet 5
Unconnected: J4.A40(POWER:PWR_CTRL_SW) J4.B40(POWER:PWR_CTRL_SW)

### Notes on the sheet
- <3B5 | <3B5 | <3B5
- <3B5> | <3B5> | <3B5>
- <5A5 | <5B5 | <5C5
- 5A5> | 5B5> | 5C5>
- <3B5 | <3B5 | <3B5
- <3B5> | <3B5> | <3B5>
- <5B5
- 5B5>

## Sheet 14 of 14
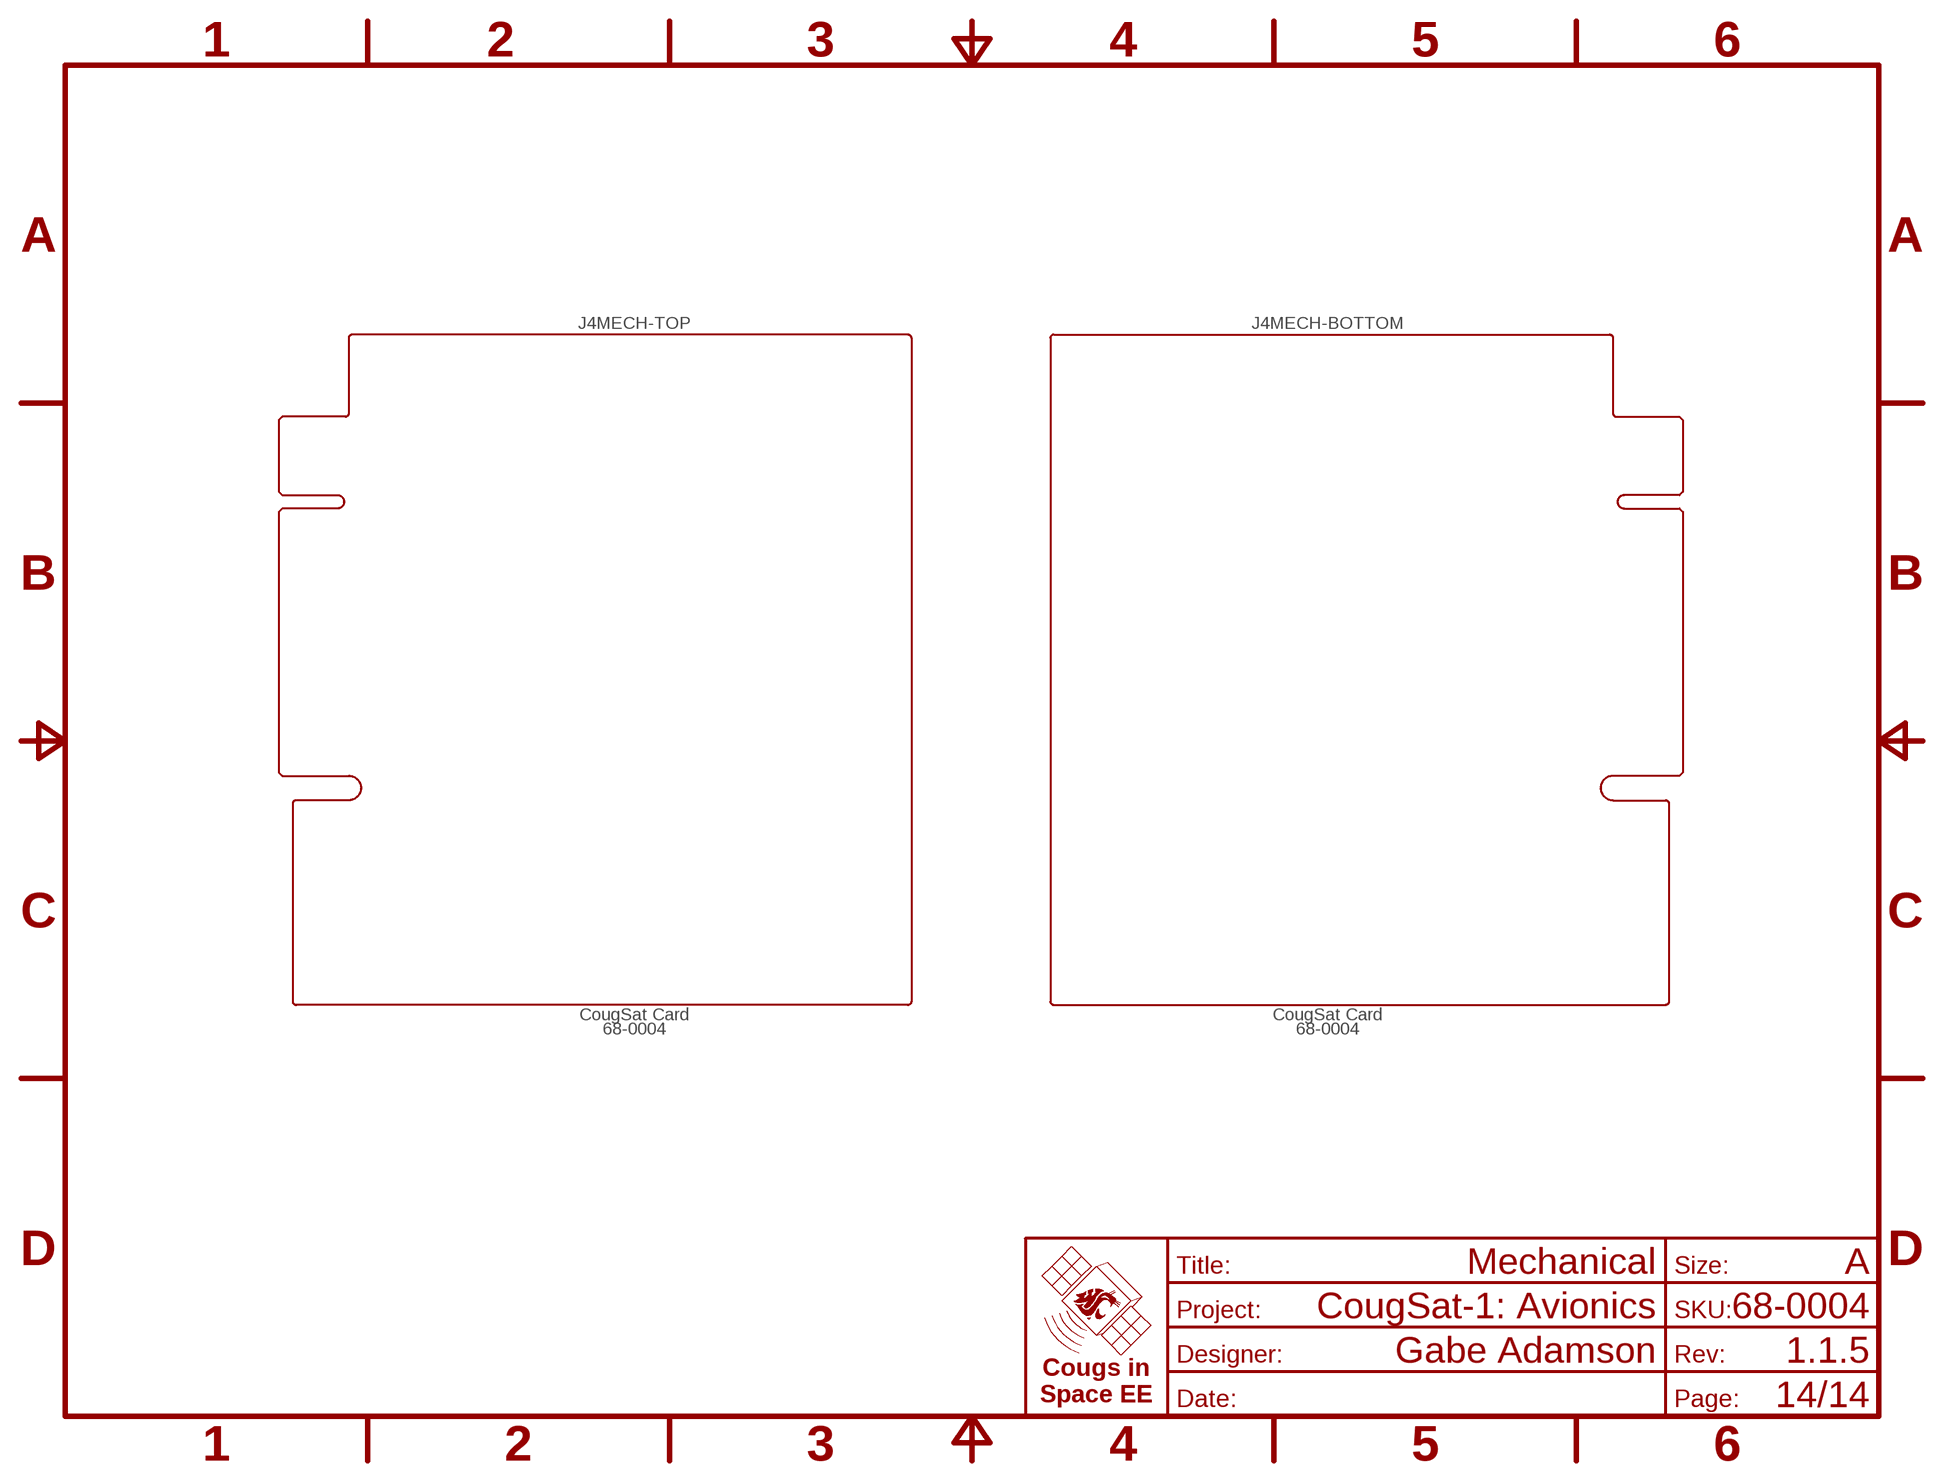
[diagram p13: schematic, sheet 14]
FRAME11 (FRAME-A): TITLE: Mechanical

## Power pins joined to a net without a drawn wire
PR_3.3V-1: J4.A2(POWER:PR_3.3V-1) J4.B2(POWER:PR_3.3V-1)
PR_3.3V-3: J4.A4(POWER:PR_3.3V-3) J4.B4(POWER:PR_3.3V-3)
PR_3.3V-4: J4.A5(POWER:PR_3.3V-4) J4.B5(POWER:PR_3.3V-4)
PR_3.3V-6: J4.A7(POWER:PR_3.3V-6) J4.B7(POWER:PR_3.3V-6)
PR_3.3V-7: J4.A8(POWER:PR_3.3V-7) J4.B8(POWER:PR_3.3V-7)
PR_3.3V-8: J4.A9(POWER:PR_3.3V-8) J4.B9(POWER:PR_3.3V-8)
PR_3.3V-9: J4.A10(POWER:PR_3.3V-9) J4.B10(POWER:PR_3.3V-9)
PR_3.3V-10: J4.A11(POWER:PR_3.3V-10) J4.B11(POWER:PR_3.3V-10)
PR_3.3V-11: J4.A12(POWER:PR_3.3V-11) J4.B12(POWER:PR_3.3V-11)
PR_3.3V-12: J4.A13(POWER:PR_3.3V-12) J4.B13(POWER:PR_3.3V-12)
PR_BATT-0: J4.A14(POWER:PR_BATT-0) J4.B14(POWER:PR_BATT-0)
PR_BATT-1: J4.A15(POWER:PR_BATT-1) J4.B15(POWER:PR_BATT-1)
PR_BATT-2: J4.A16(POWER:PR_BATT-2) J4.B16(POWER:PR_BATT-2)
PR_BATT-3: J4.A17(POWER:PR_BATT-3) J4.B17(POWER:PR_BATT-3)
PR_BATT-4: J4.A18(POWER:PR_BATT-4) J4.B18(POWER:PR_BATT-4)
PR_BATT-6: J4.A20(POWER:PR_BATT-6) J4.B20(POWER:PR_BATT-6)

## Library data of the parts
C1 C2 C9 C16 C58 C59 = CougsInSpace-Capacitors:CAP-V: Capacitor - Vertical Orientation; PACKAGE: 1608; SKU: 11-100A; TEMP: C0G; VOLTAGE: 100V
C3 C19 C22 = CougsInSpace-Capacitors:CAP-V: Capacitor - Vertical Orientation; PACKAGE: 1608; SKU: 11-103A; TEMP: X7R; VOLTAGE: 50V
C4 C32 C38 = CougsInSpace-Capacitors:CAP-H: Capacitor - Horizontal Orientation; PACKAGE: 1608; SKU: 11-104A; TEMP: X7R; VOLTAGE: 50V
C5-C7 C11 C12 C15 C20 C21 C25 C29-C31 C33 C39 C40 C43 C45-C49 C53-C57 C60-C63 C65 C70-C77 C79-C87 C92 C94-C96 C99-C102 = CougsInSpace-Capacitors:CAP-V: Capacitor - Vertical Orientation; PACKAGE: 1608; SKU: 11-104A; TEMP: X7R; VOLTAGE: 50V
C8 C35 C41 = CougsInSpace-Capacitors:CAP-V: Capacitor - Vertical Orientation; PACKAGE: 1608; SKU: 11-682A; TEMP: C0G; VOLTAGE: 50V
C10 C69 C88-C90 = CougsInSpace-Capacitors:CAP-V: Capacitor - Vertical Orientation; PACKAGE: 1608; SKU: 11-105A; TEMP: X5R; VOLTAGE: 6.3V
C13 C14 C17 C18 C23 C24 C26-C28 C36 C37 C42 = CougsInSpace-Capacitors:CAP-V: Capacitor - Vertical Orientation; PACKAGE: 1608; SKU: 11-150A; TEMP: C0G; VOLTAGE: 100V
C34 C64 C66 = CougsInSpace-Capacitors:CAP-V: Capacitor - Vertical Orientation; PACKAGE: 1608; SKU: 11-106A; TEMP: X5R; VOLTAGE: 6.3V
C78 = CougsInSpace-Capacitors:CAP-POL-V: Capacitor Polarized - Vertical Orientation; ESR: Max 400mΩ; PACKAGE: Tant-B; SKU: 16-476A; VOLTAGE: 10V
C91 C93 = CougsInSpace-Capacitors:CAP-POL-V: Capacitor Polarized - Vertical Orientation; ESR: Max 900mΩ; PACKAGE: Tant-B; SKU: 16-475A; VOLTAGE: 20V
DS1 = CougsInSpace-LEDs:LED-V: LED Vertical; CURRENT: 20mA; PACKAGE: 1608; SKU: 63-0001; VF: 2.2V
DS2 = CougsInSpace-LEDs:LED-H: LED Horizontal; CURRENT: 20mA; PACKAGE: 1608; SKU: 63-0004; VF: 3.3V
DS3 = CougsInSpace-LEDs:LED-H: LED Horizontal; CURRENT: 20mA; PACKAGE: 1608; SKU: 63-0003; VF: 2.1V
DS5 = CougsInSpace-LEDs:LED-H: LED Horizontal; CURRENT: 20mA; PACKAGE: 1608; SKU: 63-0001; VF: 2.2V
FB1 FB2 = CougsInSpace-Coils:CHOKE-H: Choke (Ferrite Bead) Horizontal; CURRENT: 500mA; DCR: 500mΩ; PACKAGE: 1608; SKU: 36-152A
J1 = CougsInSpace-Connectors:COAX: Coax Connector; PACKAGE: U.FL; SKU: 04-0008
J2 J6 J10 J16 = CougsInSpace-Connectors:µSD-SW: µSD with Detection Switch; SKU: 04-0005
J3 J8 J9 = CougsInSpace-Connectors:SWD: Serial Wire Debug; PACKAGE: SMD-6-R; SKU: 04-0004
J4 = CougsInSpace-Boards:CIS_CARD: CougSat Card; SKU: 68-0004
J5 J11-J15 = CougsInSpace-Connectors:1X04: Generic Connector - 4 Conductor; PACKAGE: PicoLock; SKU: 04-0001
L1 = CougsInSpace-Coils:INDUCTOR-V: Inductor Vertical; CURRENT: 600mA; DCR: 220mΩ; PACKAGE: 1608; SKU: 31-330A
R1-R4 = CougsInSpace-Resistors:RES-V: Resistor Vertical; PACKAGE: 1608; POWER: 1/10W; SKU: 21-0000; TEMP: 70°C Max 2A
R5 R23 R45 = CougsInSpace-Resistors:RES-H: Resistor Horizontal; PACKAGE: 1608; POWER: 1/10W; SKU: 21-0000; TEMP: 70°C Max 2A
R6 R7 R12 R17 R20 R25 R32 R39-R41 R43 R44 = CougsInSpace-Resistors:RES-V: Resistor Vertical; PACKAGE: 1608; POWER: 1/8W; SKU: 21-1002; TEMP: 25ppm/°C
R13 R27 R42 R46 = CougsInSpace-Resistors:RES-H: Resistor Horizontal; PACKAGE: 1608; POWER: 1/8W; SKU: 21-1001; TEMP: 25ppm/°C
R19 R21 R22 R26 R36-R38 = CougsInSpace-Resistors:RES-V: Resistor Vertical; PACKAGE: 1608; POWER: 1/8W; SKU: 21-1001; TEMP: 25ppm/°C
R29-R31 = CougsInSpace-Resistors:RES-H: Resistor Horizontal; PACKAGE: 1608; POWER: 1/5W; SKU: 21-0.05; TEMP: 75ppm/°C
RN1 = CougsInSpace-Resistors:RES-H-PAIRED: Resistor Horizontal - Two Paired Elements; PACKAGE: 1616; POWER: 1/8W; SKU: 26-0006; TEMP: ±10ppm/°C
RN2 RN3 RN18 = CougsInSpace-Resistors:RES_BUS-10: Resistor Bussed Array All resistors share a common terminal; PACKAGE: 3264; POWER: 1/16W; SKU: 26-0001; TEMP: 200ppm/°C
RT1-RT19 = CougsInSpace-Resistors:THERMISTOR-V: Thermistor Vertical; B2585: 3960K 1%; PACKAGE: 1608; SKU: 26-0008
TP1 TP2 = CougsInSpace-Connectors:TEST_POINT: Test Point Used to probe points in a circuit for debugging or general measurement
U1-U3 = CougsInSpace-IC-µController:STM32-64P-?*: STM 32b µController - 64 Pin STM32L476Rx <https://github.com/CougsInSpace/Resources/blob/master/SupplierDocuments/ST/STM32L476.pdf> STM32L496Rx <https://github.com/CougsInSpace/Resources/blob/master/SupplierDocuments/ST/STM32L496.pdf>; EXTRAPIN: PD2; FLASH: 1MB; SKU: 61-0002
U4 U11 = CougsInSpace-IC-Memory:EEPROM-I2C-4: EEPROM I²C - 4 Addresses M24M01 <https://github.com/CougsInSpace/Resources/blob/master/SupplierDocuments/ST/M24M01_EEPROM-I2C.pdf>; SKU: 29-0001
U5 U12 U13 U17 U18 U22 U23 U27 = CougsInSpace-IC-Comms:LEVEL_SHIFTER-2BIT: Logic Level Shifter Bidirectional - 2b; SKU: 09-0001
U6 U7 U30 = CougsInSpace-IC-Other:DRV883*: H-Bridge Driver DRV883x <https://github.com/CougsInSpace/Resources/blob/master/SupplierDocuments/Ti/DRV8837_HBridge.pdf>; CONTROL: PWM; SKU: 62-0003
U8 U25 U26 = CougsInSpace-IC-Conversion:AD7291: AD7291 12b ADC with 8-single ended channels. I²C interface; SKU: 27-0003
U9 = CougsInSpace-RF:VENUS838FLPX: GPS Reciever - GPIO Venus838FLPx <https://github.com/CougsInSpace/Resources/blob/master/SupplierDocuments/SkyTraq/Venus838FLPx-SPC_CubeSatGPS.pdf>; SKU: 65-0001
U10 U15 U16 = CougsInSpace-Sensors:BNO055: 9-DOF IMU BMO055 <https://github.com/CougsInSpace/Resources/blob/master/SupplierDocuments/Bosch/BMO055.pdf>; SKU: 66-0002
U14 U19 U24 U29 = CougsInSpace-IC-Amplifiers:OPAMP-1: Operational Amplifier - Single; SKU: 08-0002
U20 U21 U28 = CougsInSpace-IC-Amplifiers:INA199: INA199 Current-sense amplifier; GAIN: 100 V/V; SKU: 08-0004
Y1 Y3 Y5 = CougsInSpace-Clocks:CRYSTAL-GROUNDED: Crystal Grounded; LOADCAP: 10pF; SKU: 40-805A
Y2 Y4 Y6-Y8 Y10 = CougsInSpace-Clocks:CRYSTAL: Crystal; LOADCAP: 12.5pF; SKU: 40-323A

## Net classes
1 Power: width 0.2 mm